# EAGLE design node (EAGLE 9.6.2)

## Sheet 1 of 5: MCU
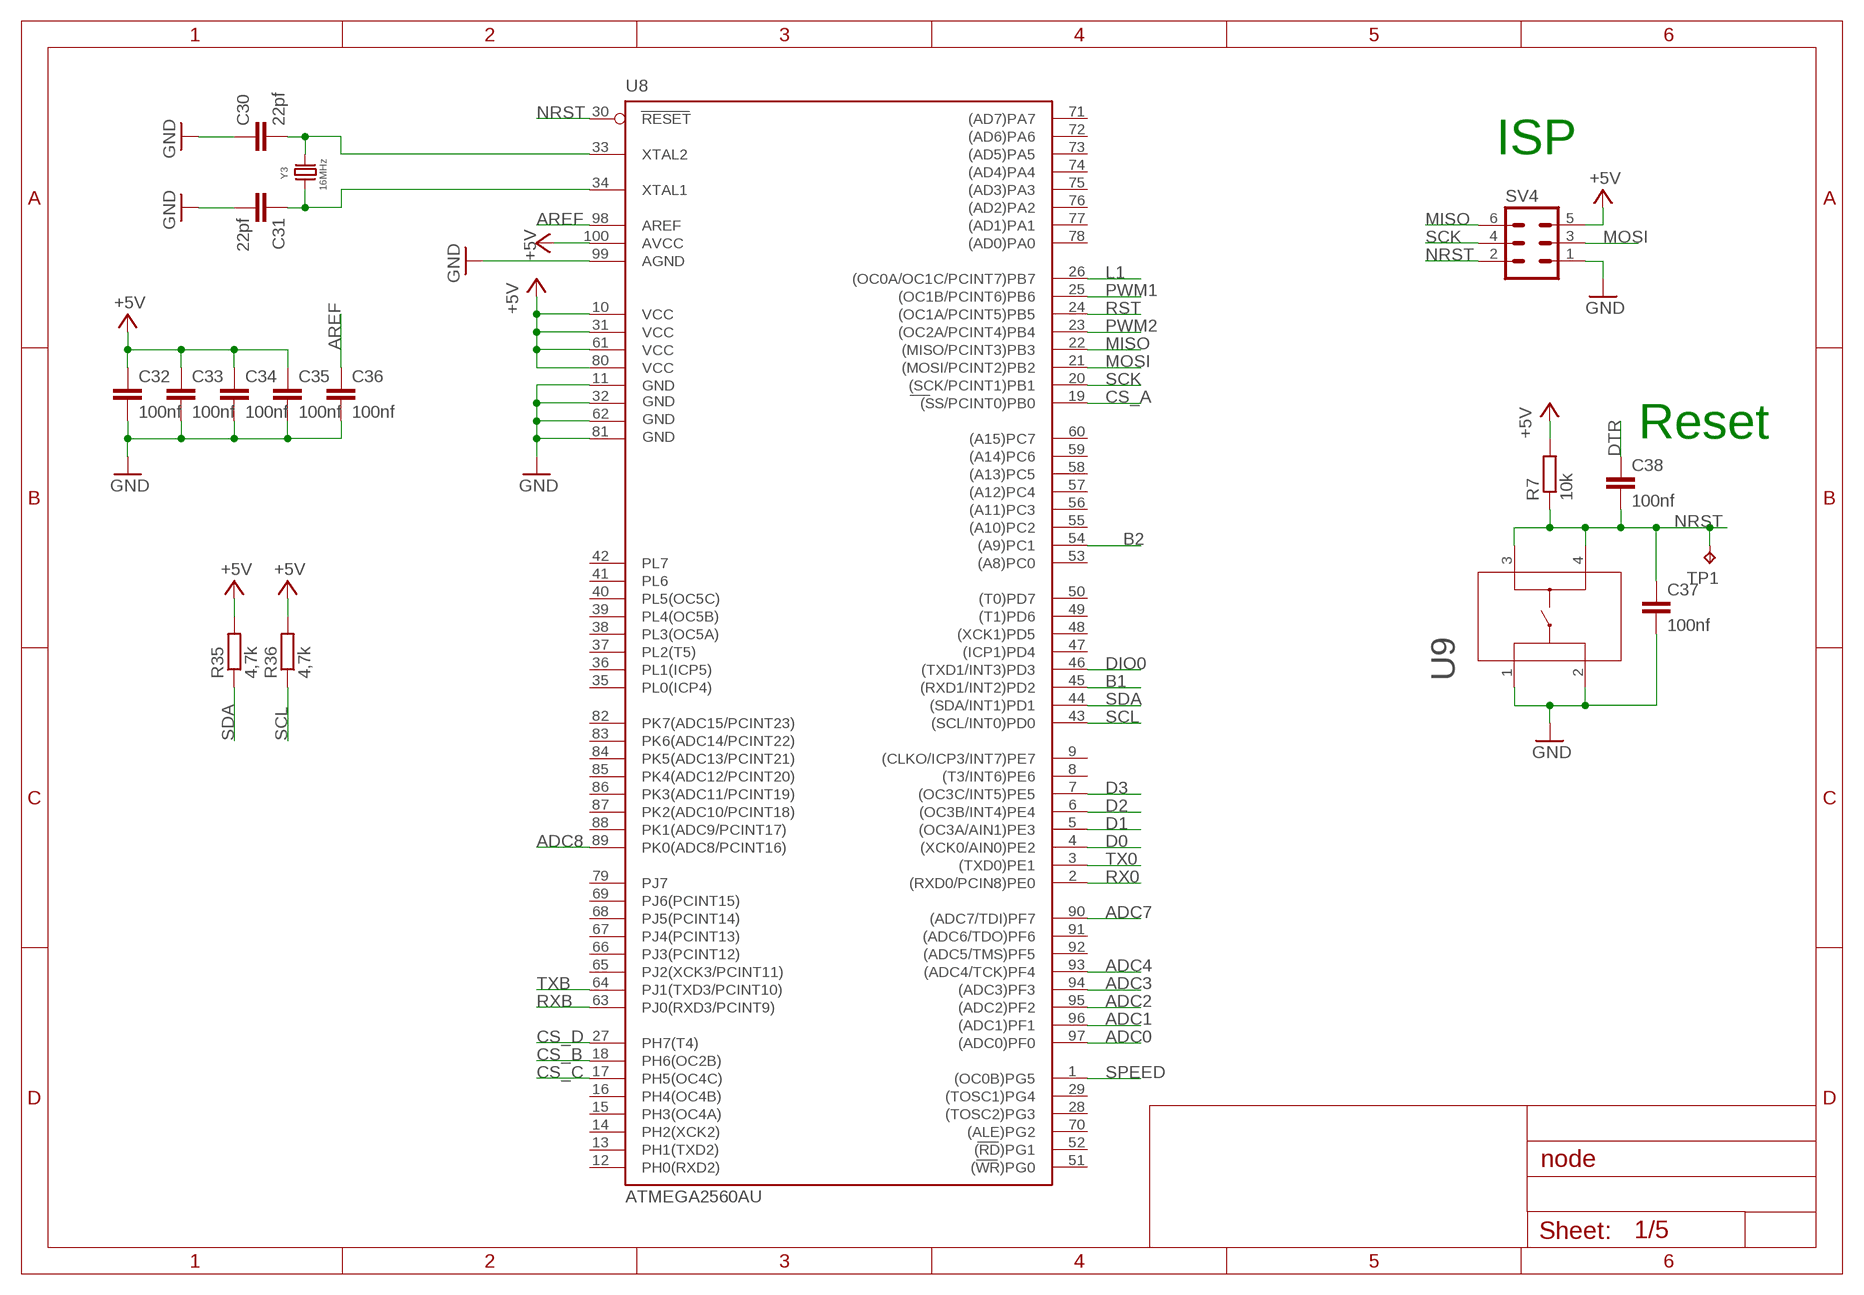
[diagram p0: schematic, sheet 1]

### Parts
C30  22pf  C-EUC0603  [C0603]
C31  22pf  C-EUC0603  [C0603]
C32  100nf  C-EUC0805  [C0805]
C33  100nf  C-EUC0805  [C0805]
C34  100nf  C-EUC0805  [C0805]
C35  100nf  C-EUC0805  [C0805]
C36  100nf  C-EUC0805  [C0805]
C37  100nf  C-EUC0805  [C0805]
C38  100nf  C-EUC0805  [C0805]
R7  10k  R-EU_R0805  [R0805]
R35  4,7k  R-EU_R0603  [R0603]
R36  4,7k  R-EU_R0603  [R0603]
SV4  MA03-2  [MA03-2]
TP1  TPTP13R  [TP13R]
U8  ATMEGA2560AU  [TQFP100]
U9  1-1825910-0  [SWITCH_1-1825910-0]
Y3  16MHz  WE-XTAL_HC49/4H_830003240B  [WE-XTAL_HC49/4H]

### Nets
+5V: C32.1 C33.1 C34.1 C35.1 R7.2 R35.2 R36.2 SV4.5 U8.10(VCC) U8.31(VCC1) U8.61(VCC2) U8.80(VCC3) U8.100(AVCC) ; also sheet 2,3,4,5
ADC0: U8.97((ADC0)PF0)
ADC1: U8.96((ADC1)PF1) ; also sheet 5
ADC2: U8.95((ADC2)PF2) ; also sheet 5
ADC3: U8.94((ADC3)PF3) ; also sheet 5
ADC4: U8.93((ADC4/TCK)PF4) ; also sheet 5
ADC7: U8.90((ADC7/TDI)PF7) ; also sheet 3
ADC8: U8.89(PK0(ADC8/PCINT16)) ; also sheet 5
AREF: C36.1 U8.98(AREF)
B1: U8.45((RXD1/INT2)PD2) ; also sheet 5
B2: U8.54((A9)PC1) ; also sheet 5
CS_A: U8.19((SS/PCINT0)PB0) ; also sheet 2
CS_B: U8.18(PH6(OC2B)) ; also sheet 3
CS_C: U8.17(PH5(OC4C)) ; also sheet 3
CS_D: U8.27(PH7(T4)) ; also sheet 3
D0: U8.4((XCK0/AIN0)PE2) ; also sheet 5
D1: U8.5((OC3A/AIN1)PE3) ; also sheet 5
D2: U8.6((OC3B/INT4)PE4) ; also sheet 5
D3: U8.7((OC3C/INT5)PE5) ; also sheet 5
DIO0: U8.46((TXD1/INT3)PD3) ; also sheet 2
DTR: C38.1 ; also sheet 2
GND: C30.1 C31.2 C32.2 C33.2 C34.2 C35.2 C36.2 C37.2 SV4.1 U8.11(GND) U8.32(GND1) U8.62(GND2) U8.81(GND3) U8.99(AGND) U9.1 U9.2 ; also sheet 2,3,4,5
L1: U8.26((OC0A/OC1C/PCINT7)PB7) ; also sheet 2
MISO: SV4.6 U8.22((MISO/PCINT3)PB3) ; also sheet 2,3
MOSI: SV4.3 U8.21((MOSI/PCINT2)PB2) ; also sheet 2,3
N$23: C30.2 U8.33(XTAL2) Y3.2
N$27: C31.1 U8.34(XTAL1) Y3.1
NRST: C37.1 C38.2 R7.1 SV4.2 TP1.TP U8.30(RESET) U9.3 U9.4
PWM1: U8.25((OC1B/PCINT6)PB6) ; also sheet 2
PWM2: U8.23((OC2A/PCINT4)PB4) ; also sheet 2
RST: U8.24((OC1A/PCINT5)PB5) ; also sheet 2
RX0: U8.2((RXD0/PCIN8)PE0) ; also sheet 2
RXB: U8.63(PJ0(RXD3/PCINT9)) ; also sheet 2
SCK: SV4.4 U8.20((SCK/PCINT1)PB1) ; also sheet 2,3
SCL: R36.1 U8.43((SCL/INT0)PD0) ; also sheet 2,3,4,5
SDA: R35.1 U8.44((SDA/INT1)PD1) ; also sheet 2,3,4,5
SPEED: U8.1((OC0B)PG5) ; also sheet 3
TX0: U8.3((TXD0)PE1) ; also sheet 2
TXB: U8.64(PJ1(TXD3/PCINT10)) ; also sheet 2
Unconnected: U8.8((T3/INT6)PE6) U8.9((CLKO/ICP3/INT7)PE7) U8.12(PH0(RXD2)) U8.13(PH1(TXD2)) U8.14(PH2(XCK2)) U8.15(PH3(OC4A)) U8.16(PH4(OC4B)) U8.28((TOSC2)PG3) U8.29((TOSC1)PG4) U8.35(PL0(ICP4)) U8.36(PL1(ICP5)) U8.37(PL2(T5)) U8.38(PL3(OC5A)) U8.39(PL4(OC5B)) U8.40(PL5(OC5C)) U8.41(PL6) U8.42(PL7) U8.47((ICP1)PD4) U8.48((XCK1)PD5) U8.49((T1)PD6) U8.50((T0)PD7) U8.51((WR)PG0) U8.52((RD)PG1) U8.53((A8)PC0) U8.55((A10)PC2) U8.56((A11)PC3) U8.57((A12)PC4) U8.58((A13)PC5) U8.59((A14)PC6) U8.60((A15)PC7) U8.65(PJ2(XCK3/PCINT11)) U8.66(PJ3(PCINT12)) U8.67(PJ4(PCINT13)) U8.68(PJ5(PCINT14)) U8.69(PJ6(PCINT15)) U8.70((ALE)PG2) U8.71((AD7)PA7) U8.72((AD6)PA6) U8.73((AD5)PA5) U8.74((AD4)PA4) U8.75((AD3)PA3) U8.76((AD2)PA2) U8.77((AD1)PA1) U8.78((AD0)PA0) U8.79(PJ7) U8.82(PK7(ADC15/PCINT23)) U8.83(PK6(ADC14/PCINT22)) U8.84(PK5(ADC13/PCINT21)) U8.85(PK4(ADC12/PCINT20)) U8.86(PK3(ADC11/PCINT19)) U8.87(PK2(ADC10/PCINT18)) U8.88(PK1(ADC9/PCINT17)) U8.91((ADC6/TDO)PF6) U8.92((ADC5/TMS)PF5)

### Notes on the sheet
- ISP
- Reset

## Sheet 2 of 5
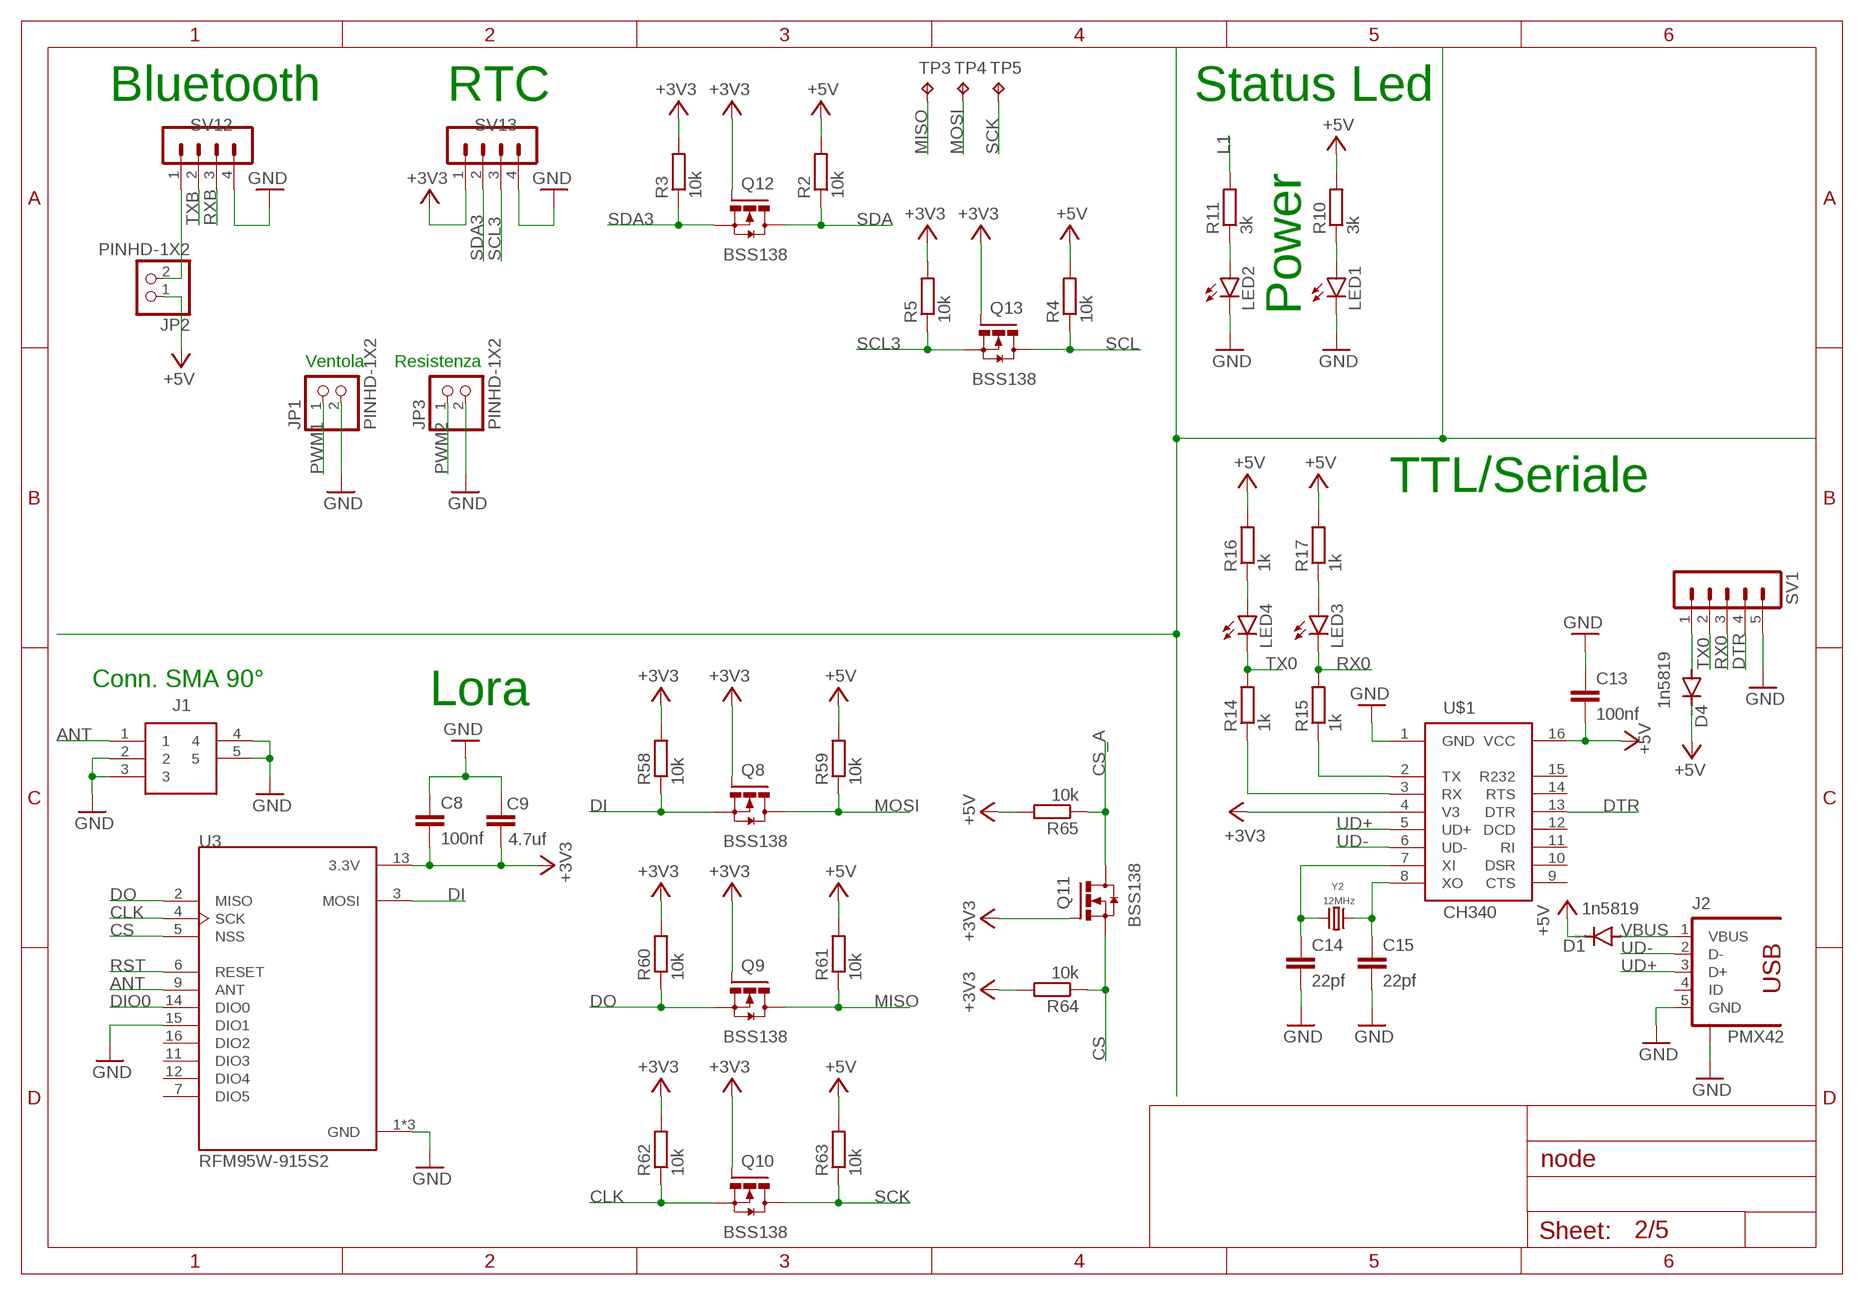
[diagram p1: schematic, sheet 2]

### Parts
C8  100nf  C-EUC0805  [C0805]
C9  4.7uf  C-EUC1206K  [C1206K]
C13  100nf  C-EUC0805  [C0805]
C14  22pf  C-EUC0603  [C0603]
C15  22pf  C-EUC0603  [C0603]
D1  1n5819  DIODE-SOD123  [SOD123]
D4  1n5819  DIODE-SOD123  [SOD123]
J1  5-1814400-1  [518144001]
J2  PMX42  PMX42_56579-0576  [PMX42_56579-0576]
JP1  PINHD-1X2  [1X02]
JP2  PINHD-1X2  [1X02]
JP3  PINHD-1X2  [1X02]
LED1  LEDSML0805  [SML0805]
LED2  LEDSML0805  [SML0805]
LED3  LEDSML0805  [SML0805]
LED4  LEDSML0805  [SML0805]
Q8  BSS138  [SOT23-3]
Q9  BSS138  [SOT23-3]
Q10  BSS138  [SOT23-3]
Q11  BSS138  [SOT23-3]
Q12  BSS138  [SOT23-3]
Q13  BSS138  [SOT23-3]
R2  10k  R-EU_R0805  [R0805]
R3  10k  R-EU_R0805  [R0805]
R4  10k  R-EU_R0805  [R0805]
R5  10k  R-EU_R0805  [R0805]
R10  3k  R-EU_R0805  [R0805]
R11  3k  R-EU_R0805  [R0805]
R14  1k  R-EU_R0805  [R0805]
R15  1k  R-EU_R0805  [R0805]
R16  1k  R-EU_R0805  [R0805]
R17  1k  R-EU_R0805  [R0805]
R58  10k  R-EU_R0805  [R0805]
R59  10k  R-EU_R0805  [R0805]
R60  10k  R-EU_R0805  [R0805]
R61  10k  R-EU_R0805  [R0805]
R62  10k  R-EU_R0805  [R0805]
R63  10k  R-EU_R0805  [R0805]
R64  10k  R-EU_R0805  [R0805]
R65  10k  R-EU_R0805  [R0805]
SV1  MA05-1  [MA05-1]
SV12  MA04-1  [MA04-1]
SV13  MA04-1  [MA04-1]
TP3  TPTP13R  [TP13R]
TP4  TPTP13R  [TP13R]
TP5  TPTP13R  [TP13R]
U3  RFM95W-915S2  [XCVR_RFM95W-915S2]
U$1  CH340  [SOIC16]
Y2  12MHz  WE-XTAL_HC49/4H_830003063B  [WE-XTAL_HC49/4H]

### Nets
+3V3: C8.2 C9.1 Q8.1(G) Q9.1(G) Q10.1(G) Q11.1(G) Q12.1(G) Q13.1(G) R3.2 R5.2 R58.2 R60.2 R62.2 R64.2 SV13.1 U3.13(3.3V) U$1.4(V3) ; also sheet 4
+5V: C13.2 D1.C D4.C JP2.1 R2.2 R4.2 R10.2 R16.2 R17.2 R59.2 R61.2 R63.2 R65.2 U$1.16(VCC) ; also sheet 1,3,4,5
ANT: J1.1 U3.9(ANT)
CLK: Q10.2(S) R62.1 U3.4(SCK)
CS: Q11.2(S) R64.1 U3.5(NSS)
CS_A: Q11.3(D) R65.1 ; also sheet 1
DI: Q8.2(S) R58.1 U3.3(MOSI)
DIO0: U3.14(DIO0) ; also sheet 1
DO: Q9.2(S) R60.1 U3.2(MISO)
DTR: SV1.4 U$1.13(DTR) ; also sheet 1
GND: C8.1 C9.2 C13.1 C14.2 C15.2 J1.2 J1.3 J1.4 J1.5 J2.5(GND) J2.S1(S) J2.S2(S) J2.S3(S) J2.S4(S) JP1.2 JP3.2 LED1.C LED2.C SV1.5 SV12.4 SV13.4 U3.1(GND) U3.8(GND) U3.10(GND) U3.15(DIO1) U$1.1(GND) ; also sheet 1,3,4,5
L1: R11.2 ; also sheet 1
MISO: Q9.3(D) R61.1 TP3.TP ; also sheet 1,3
MOSI: Q8.3(D) R59.1 TP4.TP ; also sheet 1,3
N$1: JP2.2 SV12.1
N$10: LED1.A R10.1
N$11: LED2.A R11.1
N$13: R15.1 U$1.2(TX)
N$14: R14.1 U$1.3(RX)
N$15: C15.1 U$1.8(XO) Y2.1
N$16: C14.1 U$1.7(XI) Y2.2
N$17: LED3.A R17.1
N$18: LED4.A R16.1
N$24: D4.A SV1.1
PWM1: JP1.1 ; also sheet 1
PWM2: JP3.1 ; also sheet 1
RST: U3.6(RESET) ; also sheet 1
RX0: LED3.C R15.2 SV1.3 ; also sheet 1
RXB: SV12.3 ; also sheet 1
SCK: Q10.3(D) R63.1 TP5.TP ; also sheet 1,3
SCL: Q13.3(D) R4.1 ; also sheet 1,3,4,5
SCL3: Q13.2(S) R5.1 SV13.3
SDA: Q12.3(D) R2.1 ; also sheet 1,3,4,5
SDA3: Q12.2(S) R3.1 SV13.2
TX0: LED4.C R14.2 SV1.2 ; also sheet 1
TXB: SV12.2 ; also sheet 1
UD+: J2.3(D+) U$1.5(UD+)
UD-: J2.2(D-) U$1.6(UD-)
VBUS: D1.A J2.1(VBUS)
Unconnected: J2.4(ID) U3.7(DIO5) U3.11(DIO3) U3.12(DIO4) U3.16(DIO2) U$1.9(CTS) U$1.10(DSR) U$1.11(RI) U$1.12(DCD) U$1.14(RTS) U$1.15(R232)

### Notes on the sheet
- Bluetooth | RTC | Status Led
- Power
- Ventola | Resistenza
- TTL/Seriale
- Conn. SMA 90°
- Lora

## Sheet 3 of 5
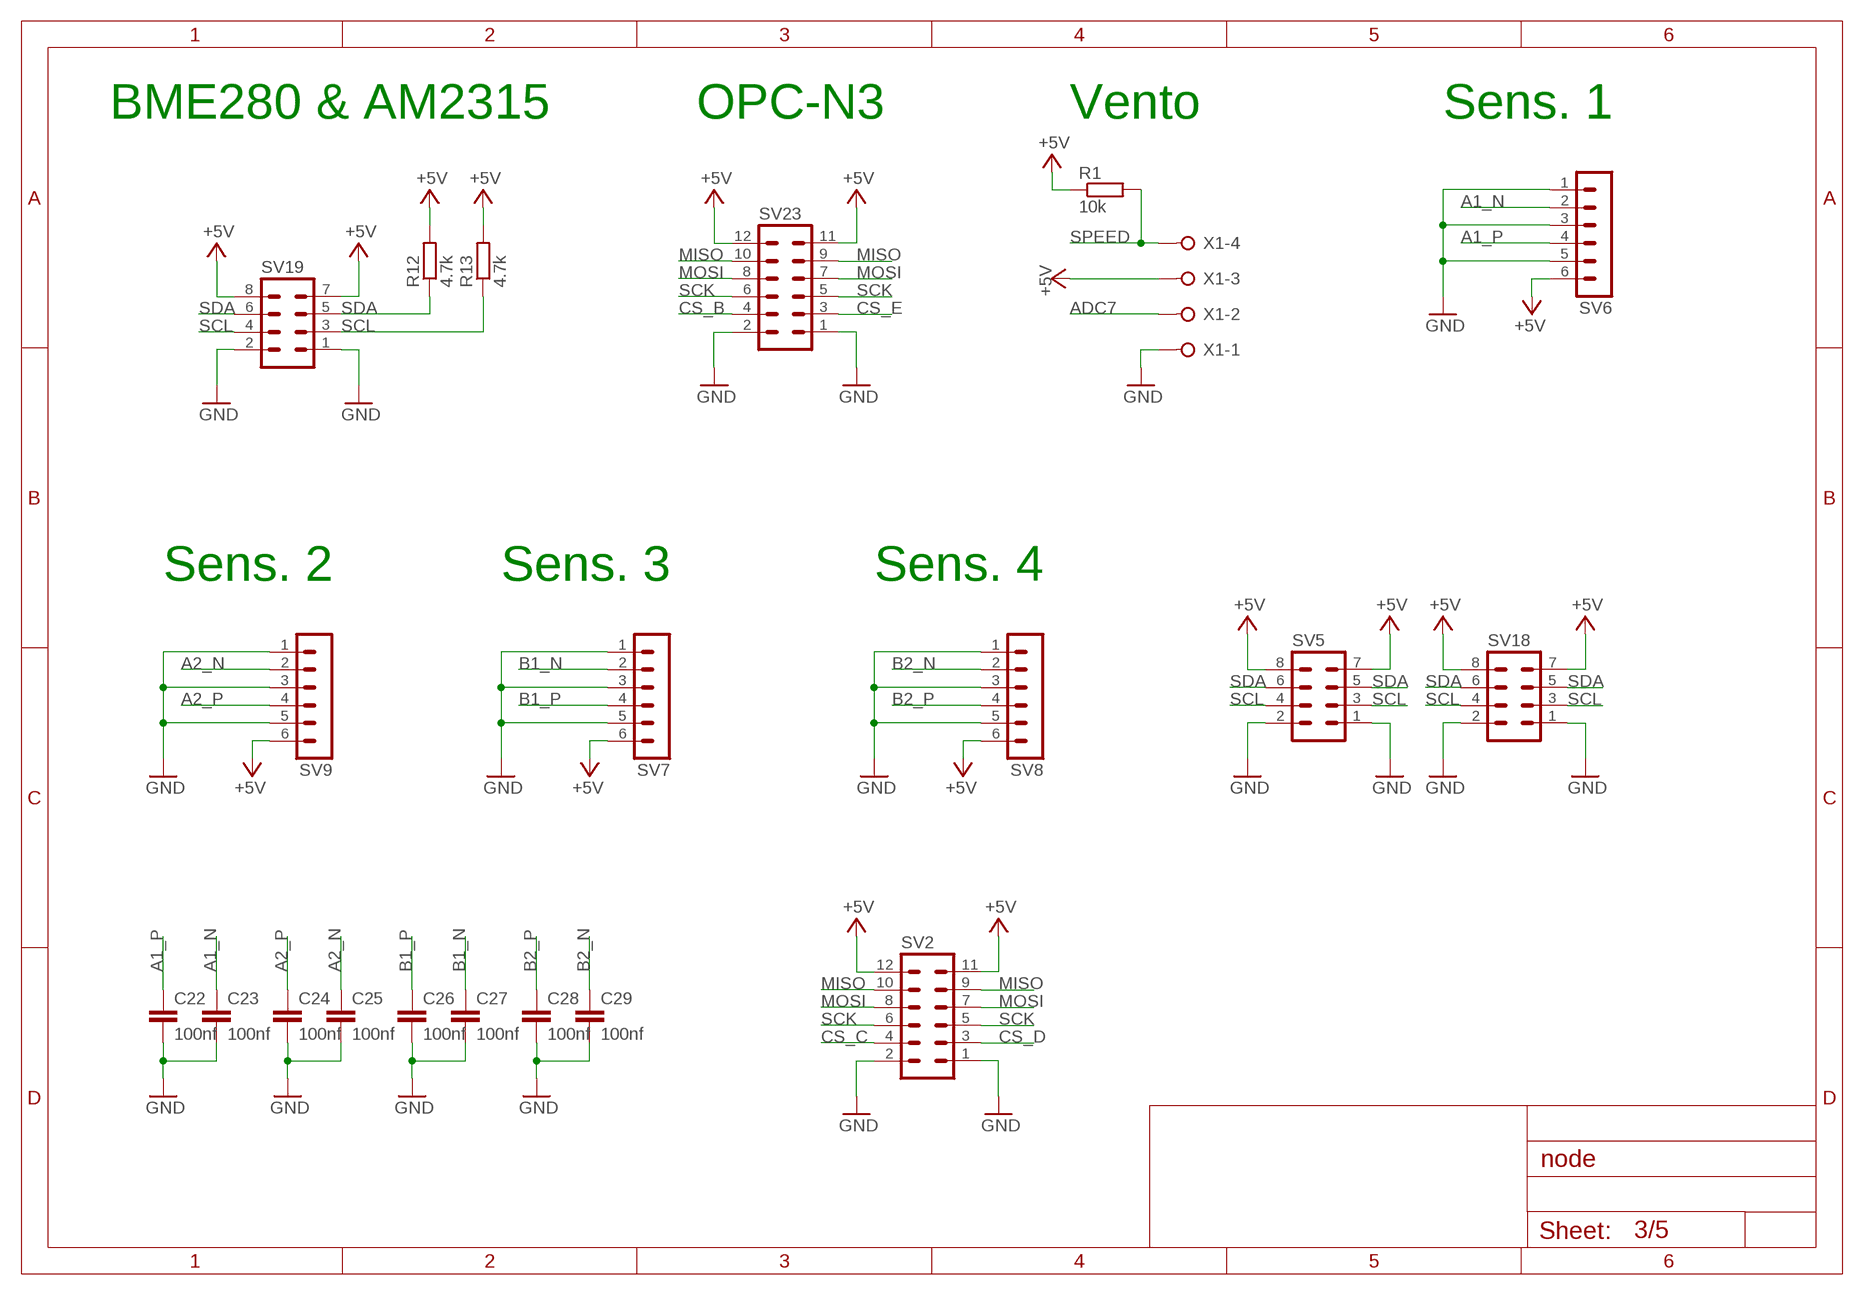
[diagram p2: schematic, sheet 3]

### Parts
C22  100nf  C-EUC0805  [C0805]
C23  100nf  C-EUC0805  [C0805]
C24  100nf  C-EUC0805  [C0805]
C25  100nf  C-EUC0805  [C0805]
C26  100nf  C-EUC0805  [C0805]
C27  100nf  C-EUC0805  [C0805]
C28  100nf  C-EUC0805  [C0805]
C29  100nf  C-EUC0805  [C0805]
R1  10k  R-EU_R0805  [R0805]
R12  4.7k  R-EU_R0603  [R0603]
R13  4.7k  R-EU_R0603  [R0603]
SV2  MA06-2  [MA06-2]
SV5  MA04-2  [MA04-2]
SV6  MA06-1  [MA06-1]
SV7  MA06-1  [MA06-1]
SV8  MA06-1  [MA06-1]
SV9  MA06-1  [MA06-1]
SV18  MA04-2  [MA04-2]
SV19  MA04-2  [MA04-2]
SV23  MA06-2  [MA06-2]
X1  W237-04P  [W237-4P]

### Nets
+5V: R1.1 R12.2 R13.2 SV2.11 SV2.12 SV5.7 SV5.8 SV6.6 SV7.6 SV8.6 SV9.6 SV18.7 SV18.8 SV19.7 SV19.8 SV23.11 SV23.12 X1.3 ; also sheet 1,2,4,5
A1_N [diff pair]: C23.1 SV6.2 ; also sheet 4
A1_P [diff pair]: C22.1 SV6.4 ; also sheet 4
A2_N [diff pair]: C25.1 SV9.2 ; also sheet 4
A2_P [diff pair]: C24.1 SV9.4 ; also sheet 4
ADC7: X1.2 ; also sheet 1
B1_N [diff pair]: C27.1 SV7.2 ; also sheet 4
B1_P [diff pair]: C26.1 SV7.4 ; also sheet 4
B2_N [diff pair]: C29.1 SV8.2 ; also sheet 4
B2_P [diff pair]: C28.1 SV8.4 ; also sheet 4
CS_B: SV23.4 ; also sheet 1
CS_C: SV2.4 ; also sheet 1
CS_D: SV2.3 ; also sheet 1
CS_E: SV23.3
GND: C22.2 C23.2 C24.2 C25.2 C26.2 C27.2 C28.2 C29.2 SV2.1 SV2.2 SV5.1 SV5.2 SV6.1 SV6.3 SV6.5 SV7.1 SV7.3 SV7.5 SV8.1 SV8.3 SV8.5 SV9.1 SV9.3 SV9.5 SV18.1 SV18.2 SV19.1 SV19.2 SV23.1 SV23.2 X1.1 ; also sheet 1,2,4,5
MISO: SV2.9 SV2.10 SV23.9 SV23.10 ; also sheet 1,2
MOSI: SV2.7 SV2.8 SV23.7 SV23.8 ; also sheet 1,2
SCK: SV2.5 SV2.6 SV23.5 SV23.6 ; also sheet 1,2
SCL: R13.1 SV5.3 SV5.4 SV18.3 SV18.4 SV19.3 SV19.4 ; also sheet 1,2,4,5
SDA: R12.1 SV5.5 SV5.6 SV18.5 SV18.6 SV19.5 SV19.6 ; also sheet 1,2,4,5
SPEED: R1.2 X1.4 ; also sheet 1

### Notes on the sheet
- BME280 & AM2315 | OPC-N3 | Vento | Sens. 1
- Sens. 2 | Sens. 3 | Sens. 4

## Sheet 4 of 5
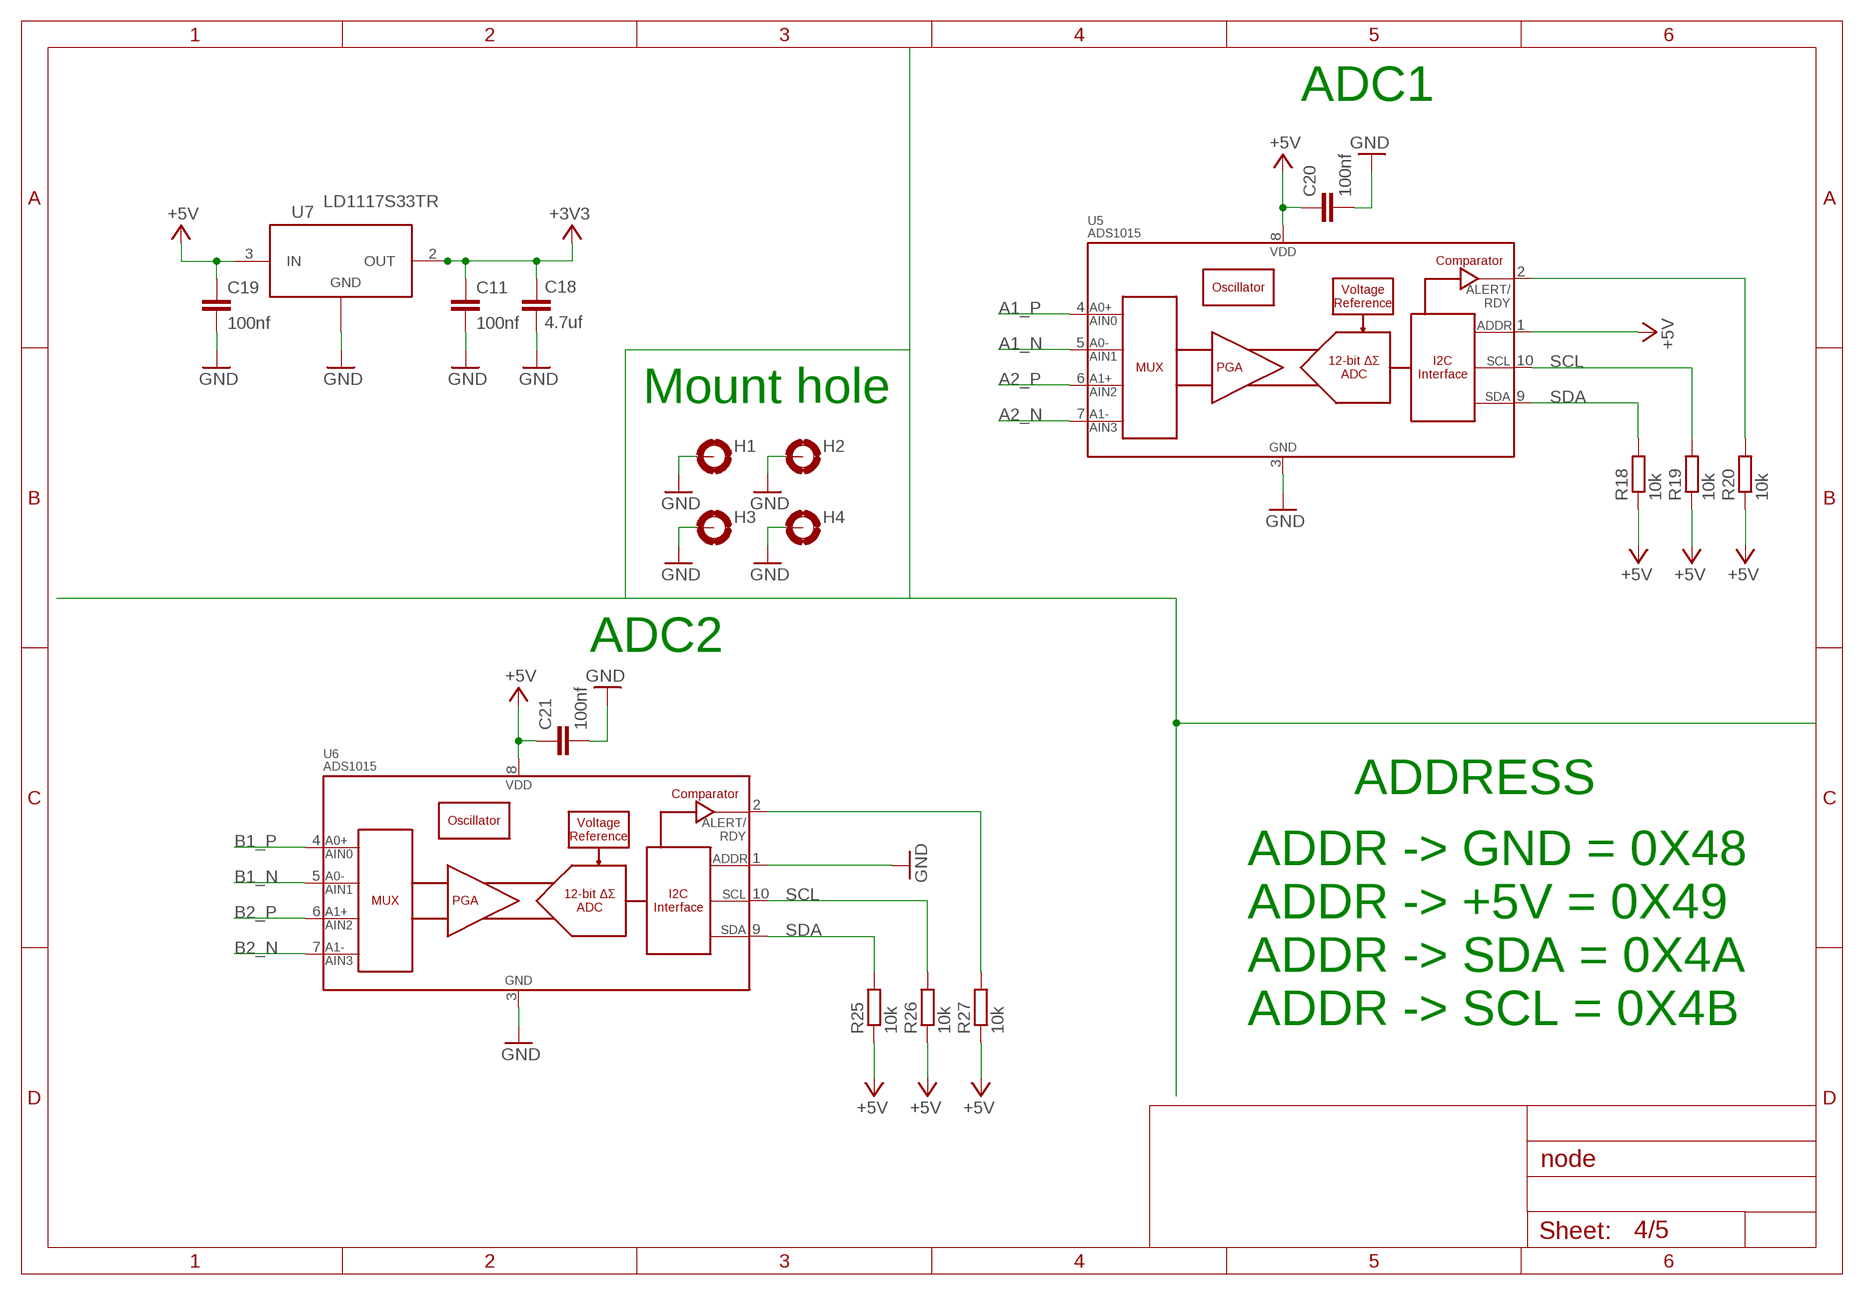
[diagram p3: schematic, sheet 4]

### Parts
C11  100nf  C-EUC0805  [C0805]
C18  4.7uf  C-EUC1206K  [C1206K]
C19  100nf  C-EUC0805  [C0805]
C20  100nf  C-EUC0805  [C0805]
C21  100nf  C-EUC0805  [C0805]
H1  MOUNT-PAD-ROUND3.2  [3,2-PAD]
H2  MOUNT-PAD-ROUND3.2  [3,2-PAD]
H3  MOUNT-PAD-ROUND3.2  [3,2-PAD]
H4  MOUNT-PAD-ROUND3.2  [3,2-PAD]
R18  10k  R-EU_R0805  [R0805]
R19  10k  R-EU_R0805  [R0805]
R20  10k  R-EU_R0805  [R0805]
R25  10k  R-EU_R0805  [R0805]
R26  10k  R-EU_R0805  [R0805]
R27  10k  R-EU_R0805  [R0805]
U5  ADS1015  [MSOP10]
U6  ADS1015  [MSOP10]
U7  LD1117S33TR  [SOT-223]

### Nets
+3V3: C11.1 C18.1 U7.2(OUT) U7.4 ; also sheet 2
+5V: C19.1 C20.1 C21.1 R18.1 R19.1 R20.1 R25.1 R26.1 R27.1 U5.1(ADDR) U5.8(VDD) U6.8(VDD) U7.3(IN) ; also sheet 1,2,3,5
A1_N [diff pair]: U5.5(AIN1) ; also sheet 3
A1_P [diff pair]: U5.4(AIN0) ; also sheet 3
A2_N [diff pair]: U5.7(AIN3) ; also sheet 3
A2_P [diff pair]: U5.6(AIN2) ; also sheet 3
B1_N [diff pair]: U6.5(AIN1) ; also sheet 3
B1_P [diff pair]: U6.4(AIN0) ; also sheet 3
B2_N [diff pair]: U6.7(AIN3) ; also sheet 3
B2_P [diff pair]: U6.6(AIN2) ; also sheet 3
GND: C11.2 C18.2 C19.2 C20.2 C21.2 H1.B3,2(MOUNT) H2.B3,2(MOUNT) H3.B3,2(MOUNT) H4.B3,2(MOUNT) U5.3(VSS) U6.1(ADDR) U6.3(VSS) U7.1(ADJ/GND) ; also sheet 1,2,3,5
N$22: R20.2 U5.2(ALERT/RDY)
N$25: R27.2 U6.2(ALERT/RDY)
SCL: R19.2 R26.2 U5.10(SCL) U6.10(SCL) ; also sheet 1,2,3,5
SDA: R18.2 R25.2 U5.9(SDA) U6.9(SDA) ; also sheet 1,2,3,5

### Notes on the sheet
- ADC1
- Mount hole
- ADC2
- ADDRESS
- ADDR -> GND = 0X48
- ADDR -> +5V = 0X49
- ADDR -> SDA = 0X4A
- ADDR -> SCL = 0X4B

## Sheet 5 of 5
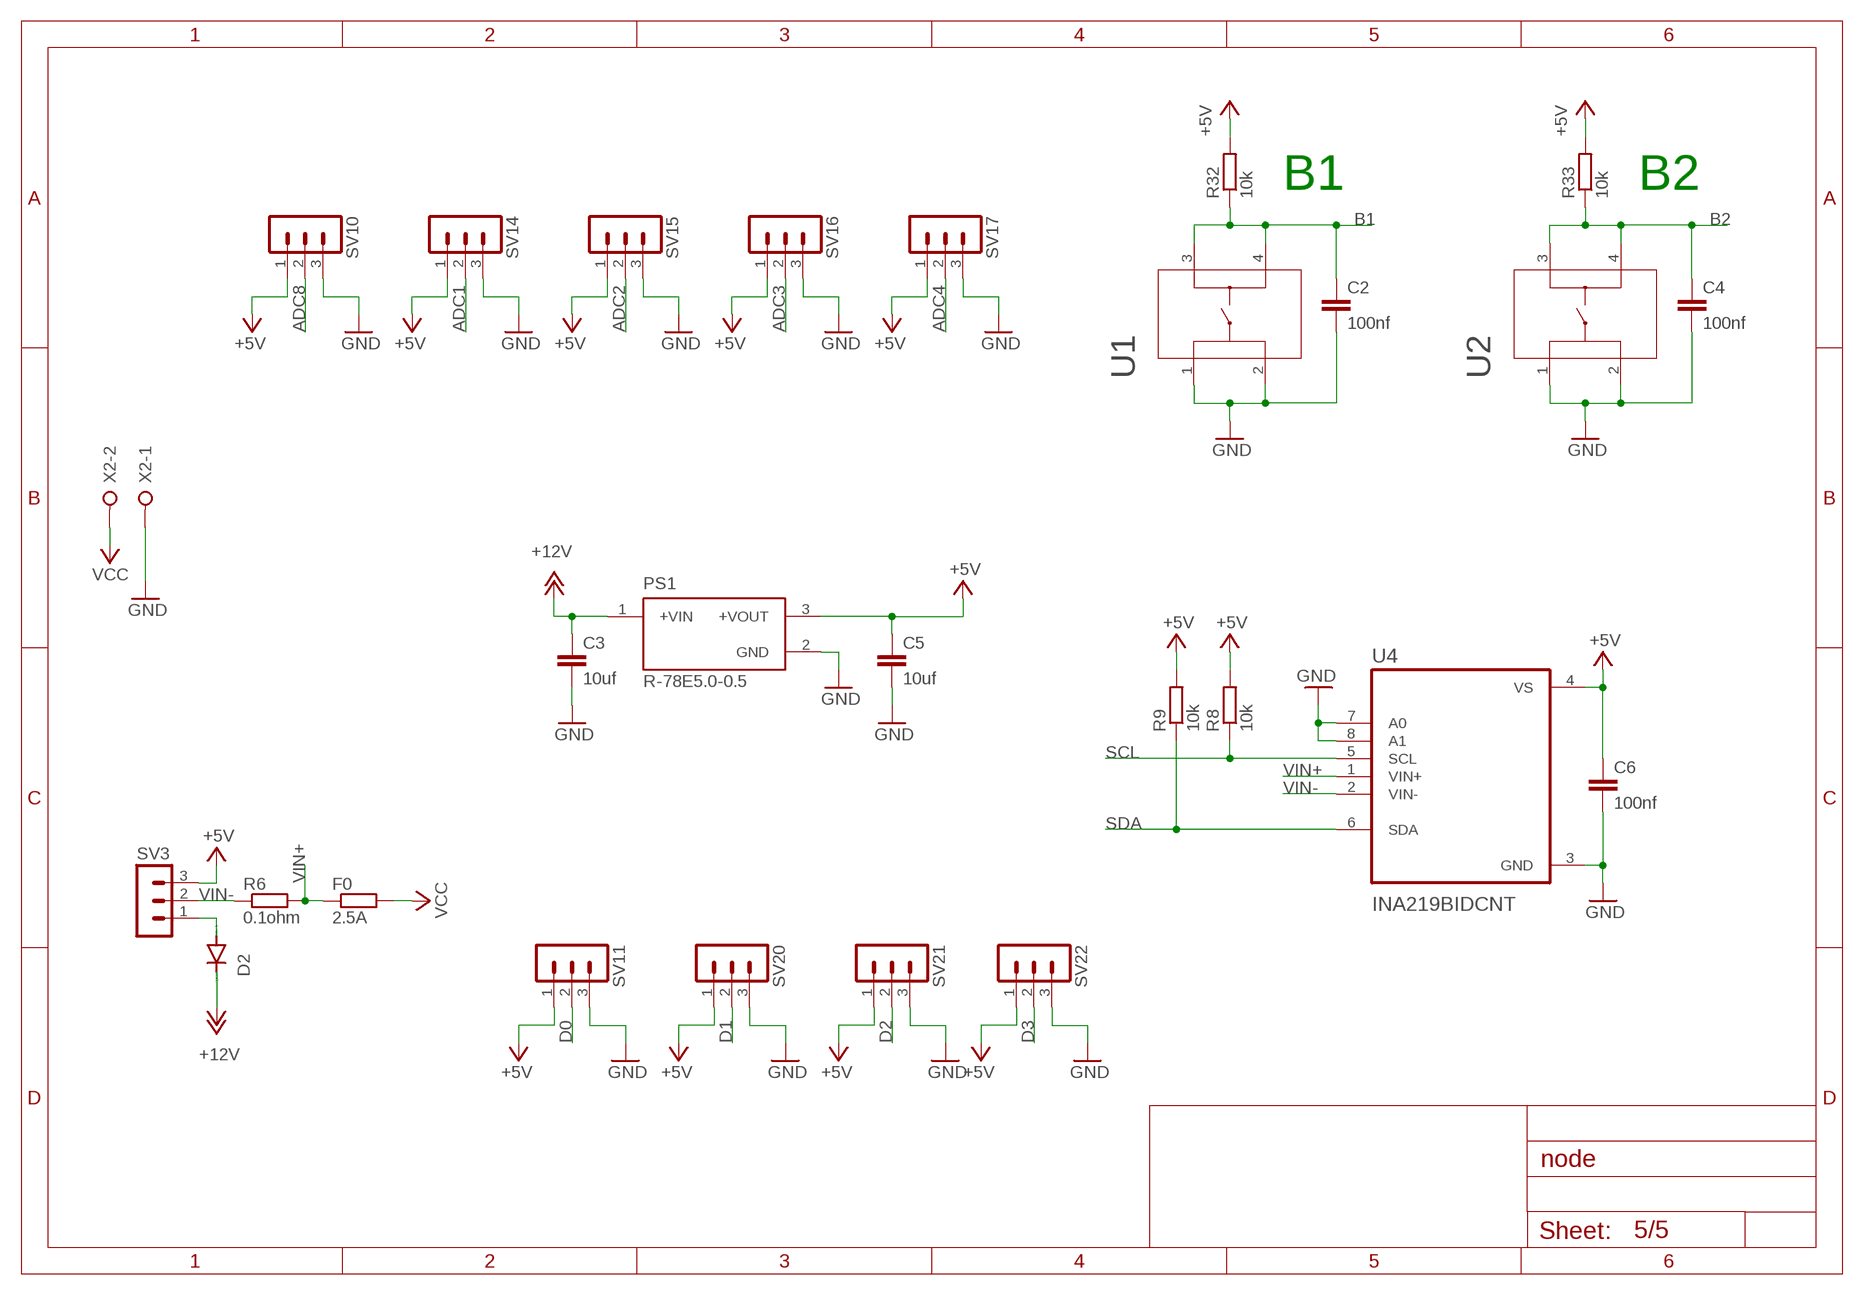
[diagram p4: schematic, sheet 5]

### Parts
C2  100nf  C-EUC0805  [C0805]
C3  10uf  C-EUC1206  [C1206]
C4  100nf  C-EUC0805  [C0805]
C5  10uf  C-EUC1206  [C1206]
C6  100nf  C-EUC0805  [C0805]
D2  DIODE-SOD123  [SOD123]
F0  2.5A  R-EU_R0805  [R0805]
PS1  R-78E5.0-0.5  [CONV_R-78E5.0-0.5]
R6  0.1ohm  R-EU_R2512  [R2512]
R8  10k  R-EU_R0805  [R0805]
R9  10k  R-EU_R0805  [R0805]
R32  10k  R-EU_R0805  [R0805]
R33  10k  R-EU_R0805  [R0805]
SV3  MA03-1  [MA03-1]
SV10  MA03-1  [MA03-1]
SV11  MA03-1  [MA03-1]
SV14  MA03-1  [MA03-1]
SV15  MA03-1  [MA03-1]
SV16  MA03-1  [MA03-1]
SV17  MA03-1  [MA03-1]
SV20  MA03-1  [MA03-1]
SV21  MA03-1  [MA03-1]
SV22  MA03-1  [MA03-1]
U1  1-1825910-0  [SWITCH_1-1825910-0]
U2  1-1825910-0  [SWITCH_1-1825910-0]
U4  INA219BIDCNT  [SOT65P280X145-8N]
X2  W237-02P  [W237-132]

### Nets
+5V: C5.1 C6.1 PS1.3(+VOUT) R8.2 R9.2 R32.2 R33.2 SV3.3 SV10.1 SV11.1 SV14.1 SV15.1 SV16.1 SV17.1 SV20.1 SV21.1 SV22.1 U4.4(VS) ; also sheet 1,2,3,4
+12V: C3.1 D2.C PS1.1(+VIN)
ADC1: SV14.2 ; also sheet 1
ADC2: SV15.2 ; also sheet 1
ADC3: SV16.2 ; also sheet 1
ADC4: SV17.2 ; also sheet 1
ADC8: SV10.2 ; also sheet 1
B1: C2.1 R32.1 U1.3 U1.4 ; also sheet 1
B2: C4.1 R33.1 U2.3 U2.4 ; also sheet 1
D0: SV11.2 ; also sheet 1
D1: SV20.2 ; also sheet 1
D2: SV21.2 ; also sheet 1
D3: SV22.2 ; also sheet 1
GND: C2.2 C3.2 C4.2 C5.2 C6.2 PS1.2(GND) SV10.3 SV11.3 SV14.3 SV15.3 SV16.3 SV17.3 SV20.3 SV21.3 SV22.3 U1.1 U1.2 U2.1 U2.2 U4.3(GND) U4.7(A0) U4.8(A1) X2.1 ; also sheet 1,2,3,4
N$3: D2.A SV3.1
SCL: R8.1 U4.5(SCL) ; also sheet 1,2,3,4
SDA: R9.1 U4.6(SDA) ; also sheet 1,2,3,4
VCC: F0.2 X2.2
VIN+: F0.1 R6.2 U4.1(VIN+)
VIN-: R6.1 SV3.2 U4.2(VIN-)

### Notes on the sheet
- B1 | B2

## Library data of the parts
C2-C6 C8 C9 C11 C13-C15 C18-C38 = resistor:C-EU: CAPACITOR, European symbol
D1 D2 D4 = diode:DIODE-: DIODE
F0 R1-R20 R25-R27 R32 R33 R35 R36 R58-R65 = resistor:R-EU_: RESISTOR, European symbol
H1-H4 = holes:MOUNT-PAD-ROUND: MOUNTING PAD, round
J1 = 5-1814400-1:5-1814400-1: SMA Connector Jack, Female Socket 50 Ohm Through Hole, Right Angle Solder Source: Datasheet <https://www.te.com/commerce/DocumentDelivery/DDEController?Action=showdoc&DocId=Customer Drawing1814400DpdfEnglishENG_CD_1814400_D_baseFilename.pdf5-1814400-1>; ALLIED_NUMBER: 70084631; ALLIED_PRICE-STOCK: https://www.alliedelec.com/te-connectivity-5-1814400-1/70084631/; DESCRIPTION: SMA Connector Jack, Female Socket 50 Ohm Through Hole, Right Angle Solder; HEIGHT: 10.43mm; MANUFACTURER_NAME: TE Connectivity; MANUFACTURER_PART_NUMBER: 5-1814400-1; MOUSER_PART_NUMBER: 571-5-1814400-1; MOUSER_PRICE-STOCK: https://www.mouser.co.uk/ProductDetail/TE-Connectivity/5-1814400-1?qs=ZMVvPt2N%252B83mDSbcJPKgOA%3D%3D; RS_PART_NUMBER: 6163400; RS_PRICE-STOCK: http://uk.rs-online.com/web/p/products/6163400
J2 = 52101-101-REV-A:PMX42_56579-0576: USB - OTG, miniUSB Type AB, Molex
JP1-JP3 = Connector:PINHD-1X2: PIN HEADER; CATEGORY: CONNECTOR; SUB-CATEGORY: PIN-HEADER
LED1-LED4 = led:LED: LED OSRAM: - CHIPLED LG R971, LG N971, LY N971, LG Q971, LY Q971, LO R971, LY R971 LH N974, LH R974 LS Q976, LO Q976, LY Q976 LO Q996 - Hyper CHIPLED LW Q18S LB Q993, LB Q99A, LB R99A - SideLED LS A670, LO A670, LY A670, LG A670, LP A670 LB A673, LV A673, LT A673, LW A673 LH A674 LY A675 LS A676, LA A676, LO A676, LY A676, LW A676 LS A679, LY A679, LG A679 - Hyper Micro SIDELED® LS Y876, LA Y876, LO Y876, LY Y876 LT Y87S - SmartLED LW L88C, LW L88S LB L89C, LB L89S, LG L890 LS L89K, LO L89K, LY L89K LS L896, LA L896, LO L896, LY L896 - TOPLED LS T670, LO T670, LY T670, LG T670, LP T670 LSG T670, LSP T670, LSY T670, LOP T670, LYG T670 LG T671, LOG T671, LSG T671 LB T673, LV T673, LT T673, LW T673 LH T674 LS T676, LA T676, LO T676, LY T676, LB T676, LH T676, LSB T676, LW T676 LB T67C, LV T67C, LT T67C, LS T67K, LO T67K, LY T67K, LW E67C LS E67B, LA E67B, LO E67B, LY E67B, LB E67C, LV E67C, LT E67C LW T67C LS T679, LY T679, LG T679 LS T770, LO T770, LY T770, LG T770, LP T770 LB T773, LV T773, LT T773, LW T773 LH T774 LS E675, LA E675, LY E675, LS T675 LS T776, LA T776, LO T776, LY T776, LB T776 LHGB T686 LT T68C, LB T68C - Hyper Mini TOPLED® LB M676 - Mini TOPLED Santana® LG M470 LS M47K, LO M47K, LY M47K Source: http://www.osram.convergy.de LUXEON: - LUMILED® LXK2-PW12-R00, LXK2-PW12-S00, LXK2-PW14-U00, LXK2-PW14-V00 LXK2-PM12-R00, LXK2-PM12-S00, LXK2-PM14-U00 LXK2-PE12-Q00, LXK2-PE12-R00, LXK2-PE12-S00, LXK2-PE14-T00, LXK2-PE14-U00 LXK2-PB12-K00, LXK2-PB12-L00, LXK2-PB12-M00, LXK2-PB14-N00, LXK2-PB14-P00, LXK2-PB14-Q00 LXK2-PR12-L00, LXK2-PR12-M00, LXK2-PR14-Q00, LXK2-PR14-R00 LXK2-PD12-Q00, LXK2-PD12-R00, LXK2-PD12-S00 LXK2-PH12-R00, LXK2-PH12-S00 LXK2-PL12-P00, LXK2-PL12-Q00, LXK2-PL12-R00 Source: www.luxeon.com KINGBRIGHT: KA-3528ASYC Source: www.kingbright.com
PS1 = R-78E5.0-0.5:R-78E5.0-0.5: 0.5 Amp SIP3 Single Output; ARROW_ELECTRONICS-PURCHASE-URL: https://snapeda.com/shop?store=Arrow+Electronics&id=229067; AVAILABILITY: Unavailable; DESCRIPTION: Switching regulator module - DC/DC converter . Single Output. 7.0V to 28.0V input voltage range and 5 V output voltage range; DIGIKEY-PURCHASE-URL: https://snapeda.com/shop?store=DigiKey&id=229067; MF: Recom Power; MOUSER-PURCHASE-URL: https://snapeda.com/shop?store=Mouser&id=229067; MP: R-78E5.0-0.5; PACKAGE: SIP-3 Recom Power; PRICE: None
Q8-Q13 = Transistor:BSS138: MOSFET N-CH 50V 220MA SOT-23 Manufacturer's datasheet <https://www.onsemi.com/pub/Collateral/BSS138-D.PDF>; CREATED_BY: PCBLayout.com; DIGIKEY_PART_NUMBER: BSS138CT-ND; MANUFACTURER: ON Semiconductor; MPN: BSS138; PACKAGE: SOT-23
SV1 = con-lstb:MA05-1: PIN HEADER; OC_FARNELL: unknown; OC_NEWARK: unknown
SV2 SV23 = con-lstb:MA06-2: PIN HEADER; OC_FARNELL: unknown; OC_NEWARK: unknown
SV3 SV10 SV11 SV14-SV17 SV20-SV22 = con-lstb:MA03-1: PIN HEADER; OC_FARNELL: unknown; OC_NEWARK: unknown
SV4 = con-lstb:MA03-2: PIN HEADER; OC_FARNELL: unknown; OC_NEWARK: unknown
SV5 SV18 SV19 = con-lstb:MA04-2: PIN HEADER; OC_FARNELL: unknown; OC_NEWARK: unknown
SV6-SV9 = con-lstb:MA06-1: PIN HEADER; OC_FARNELL: unknown; OC_NEWARK: unknown
SV12 SV13 = con-lstb:MA04-1: PIN HEADER; OC_FARNELL: unknown; OC_NEWARK: unknown
TP1 TP3-TP5 = testpad:TP: Test pad
U1 U2 U9 = Switches:1-1825910-0; BUILT_BY: EMA_UL_Team; CATEGORY: Tactile Switches; COPYRIGHT: Copyright (C) 2016 Accelerated Designs. All rights reserved; DESCRIPTION: FSM6JH=6MM TACT SWITCH, HIGH TEMP; MANUFACTURER_PART_NUMBER: 1-1825910-0; PART_STATUS: active; SERIES: Unknown; VENDOR: TE Connectivity
U3 = RFM95W-915S2:RFM95W-915S2: RFM95(W) - Low Power Long Range Transceiver Module V1.0; AVAILABILITY: Unavailable; DESCRIPTION: General ISM < 1GHz LoRa™ Transceiver Module 915MHz Surface Mount; MF: RF Solutions; MP: RFM95W-915S2; PACKAGE: SMD-16 RF Solutions; PRICE: None
U4 = INA219BIDCNT:INA219BIDCNT; AVAILABILITY: Unavailable; DESCRIPTION: 26-V, Bidirectional, Zero-Drift, High-Side, I2C Out Current/Power Monitor; MF: Texas Instruments; MP: INA219BIDCNT; PACKAGE: SOT-23-8 Texas Instruments; PRICE: None; TEXAS_INSTRUMENTS-PURCHASE-URL: https://snapeda.com/shop?store=Texas+Instruments&id=420868
U5 U6 = SparkFun-IC-Conversion:ADS1015: ADS1015 12-BIT ADC 12-Bit Del-Sig ADC Four single-ended inputs or two differential inputs Internal PGA I2C interface 2.0-5.5V SparkFun Products SparkFun Block for Intel Edison - ADC <https://www.sparkfun.com/products/13770> (DEV-13770); PROD_ID: IC-12270
U7 = IC:LD1117S33TR: IC REG LINEAR 3.3V 800MA SOT223 Manufacturer's datasheet <http://www.st.com/content/ccc/resource/technical/document/datasheet/99/3b/7d/91/91/51/4b/be/CD00000544.pdf/files/CD00000544.pdf/jcr:content/translations/en.CD00000544.pdf>; CREATED_BY: PCBLayout.com; DIGIKEY_PART_NUMBER: 497-1242-2-ND; MANUFACTURER: STMicroelectronics; MPN: LD1117S33TR; PACKAGE: SOT-223
U8 = SparkFun-IC-Microcontroller:ATMEGA2560: Atmel 100-pin 8-bit uC 64/128/256 Kbytes FLASH 4 Kbytes EEPROM 8 Kbytes SRAM 86 General Purpose I/O pins 12-channels16-bit PWM 4 x Serial USARTs 16-channels 10-bit A/D SparkFun Products None.; PROD_ID: IC-10040
U$1 = CH340:CH340; AVAILABILITY: Unavailable; DESCRIPTION: Circuit Breaker Magnetic 3Pole 40A 240VAC; MF: Eaton; MP: CH340; PACKAGE: None; PRICE: None
X1 = con-wago-508:W237-04P: WAGO SREW CLAMP; OC_FARNELL: unknown; OC_NEWARK: unknown
X2 = con-wago-508:W237-02P: WAGO SREW CLAMP; OC_FARNELL: unknown; OC_NEWARK: unknown
Y2 = Wurth_Quartz Crystals & Oscillators_WE-XTAL:WE-XTAL_HC49/4H: WE-XTAL Quartz Crystal Characteristics Industry standard packages <https://katalog.we-online.com/media/images/v2/o135919v209%20Family_WE-XTAL_IQXC-42.jpg> Details see: https://katalog.we-online.com/en/pbs/WE-XTAL Updated by Ella Wu , 2019-09-03 2019 (C) Wurth Elektronik; C-LOAD: 20pF; DATASHEET-URL: https://www.we-online.com/catalog/datasheet/830003063B.pdf; MOUNT: THT; PART-NUMBER: 830003063B; STABILITY: 50ppm; TOLERANCE: ±30ppm; VALUE: 3.579545MHz
Y3 = Wurth_Quartz Crystals & Oscillators_WE-XTAL:WE-XTAL_HC49/4H: WE-XTAL Quartz Crystal Characteristics Industry standard packages <https://katalog.we-online.com/media/images/v2/o135919v209%20Family_WE-XTAL_IQXC-42.jpg> Details see: https://katalog.we-online.com/en/pbs/WE-XTAL Updated by Ella Wu , 2019-09-03 2019 (C) Wurth Elektronik; C-LOAD: 30pF; DATASHEET-URL: https://www.we-online.com/catalog/datasheet/830003240B.pdf; MOUNT: THT; PART-NUMBER: 830003240B; STABILITY: 50ppm; TOLERANCE: ±30ppm

## Net classes
1 diff pair: width 0.305 mm, clearance 0.127 mm

## Board
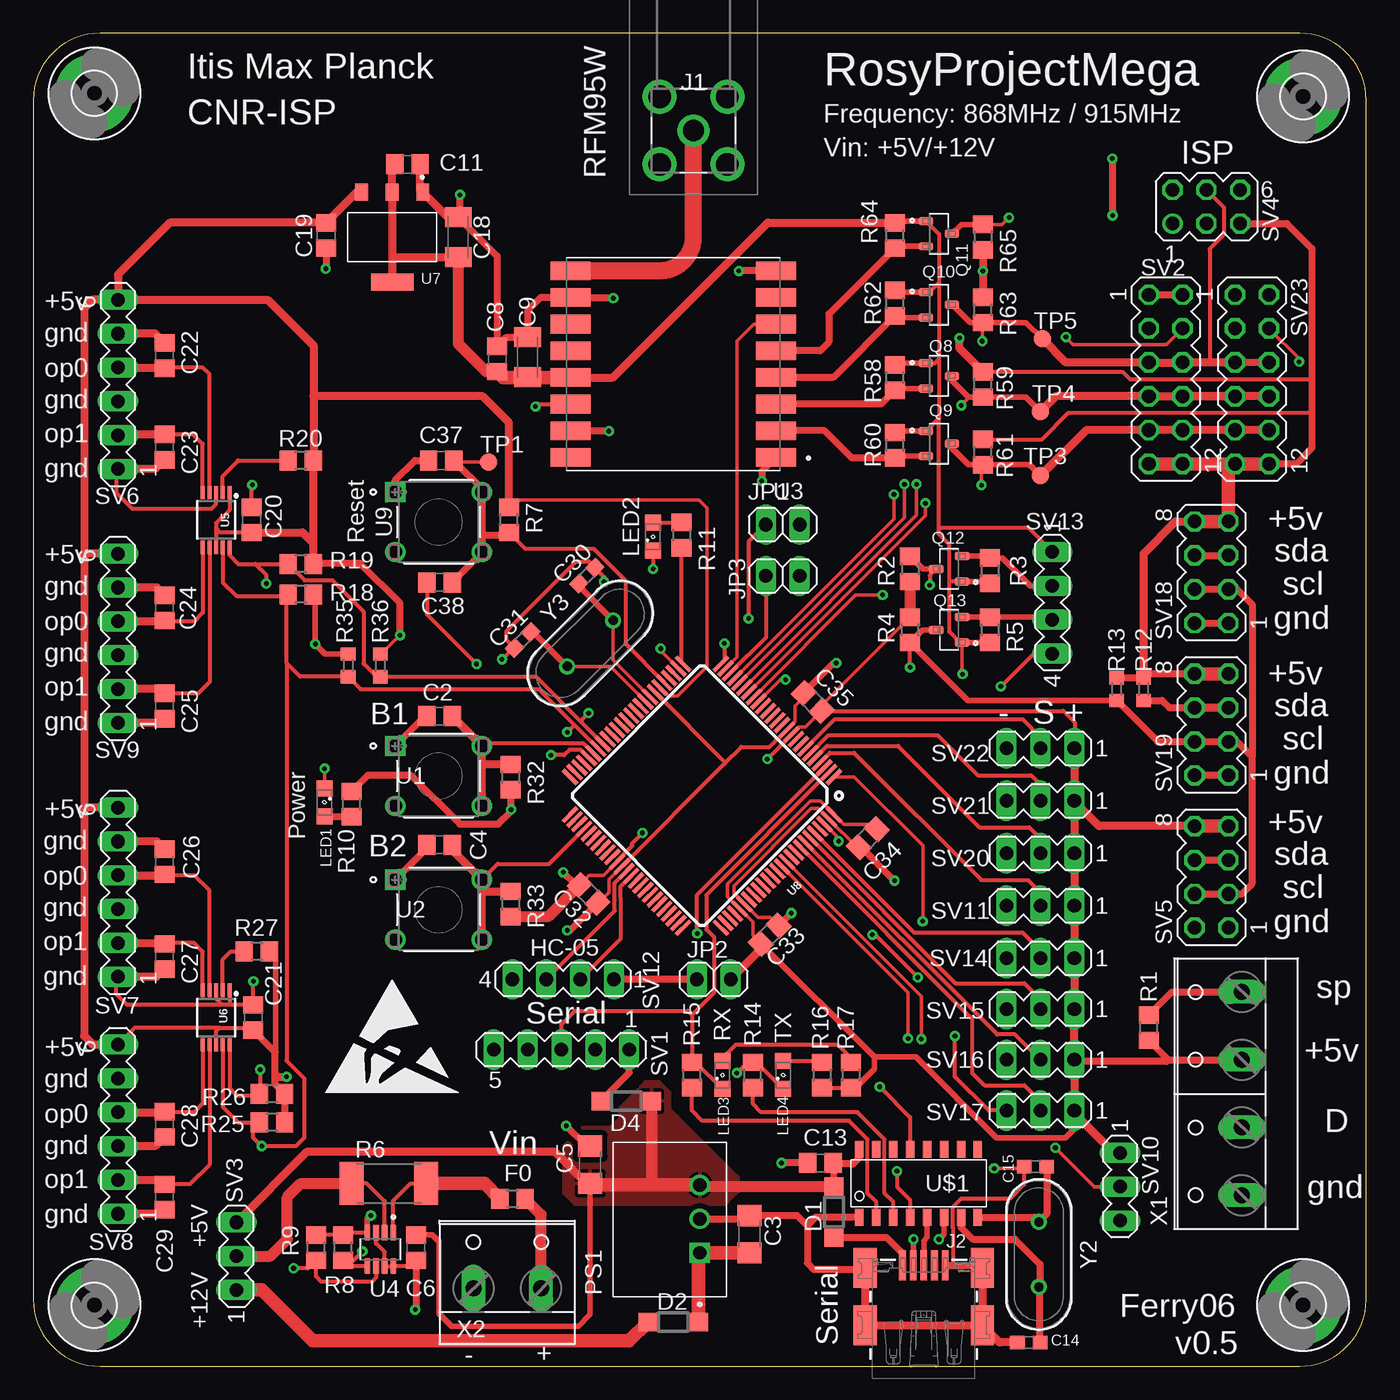
[diagram p5: board, top side]
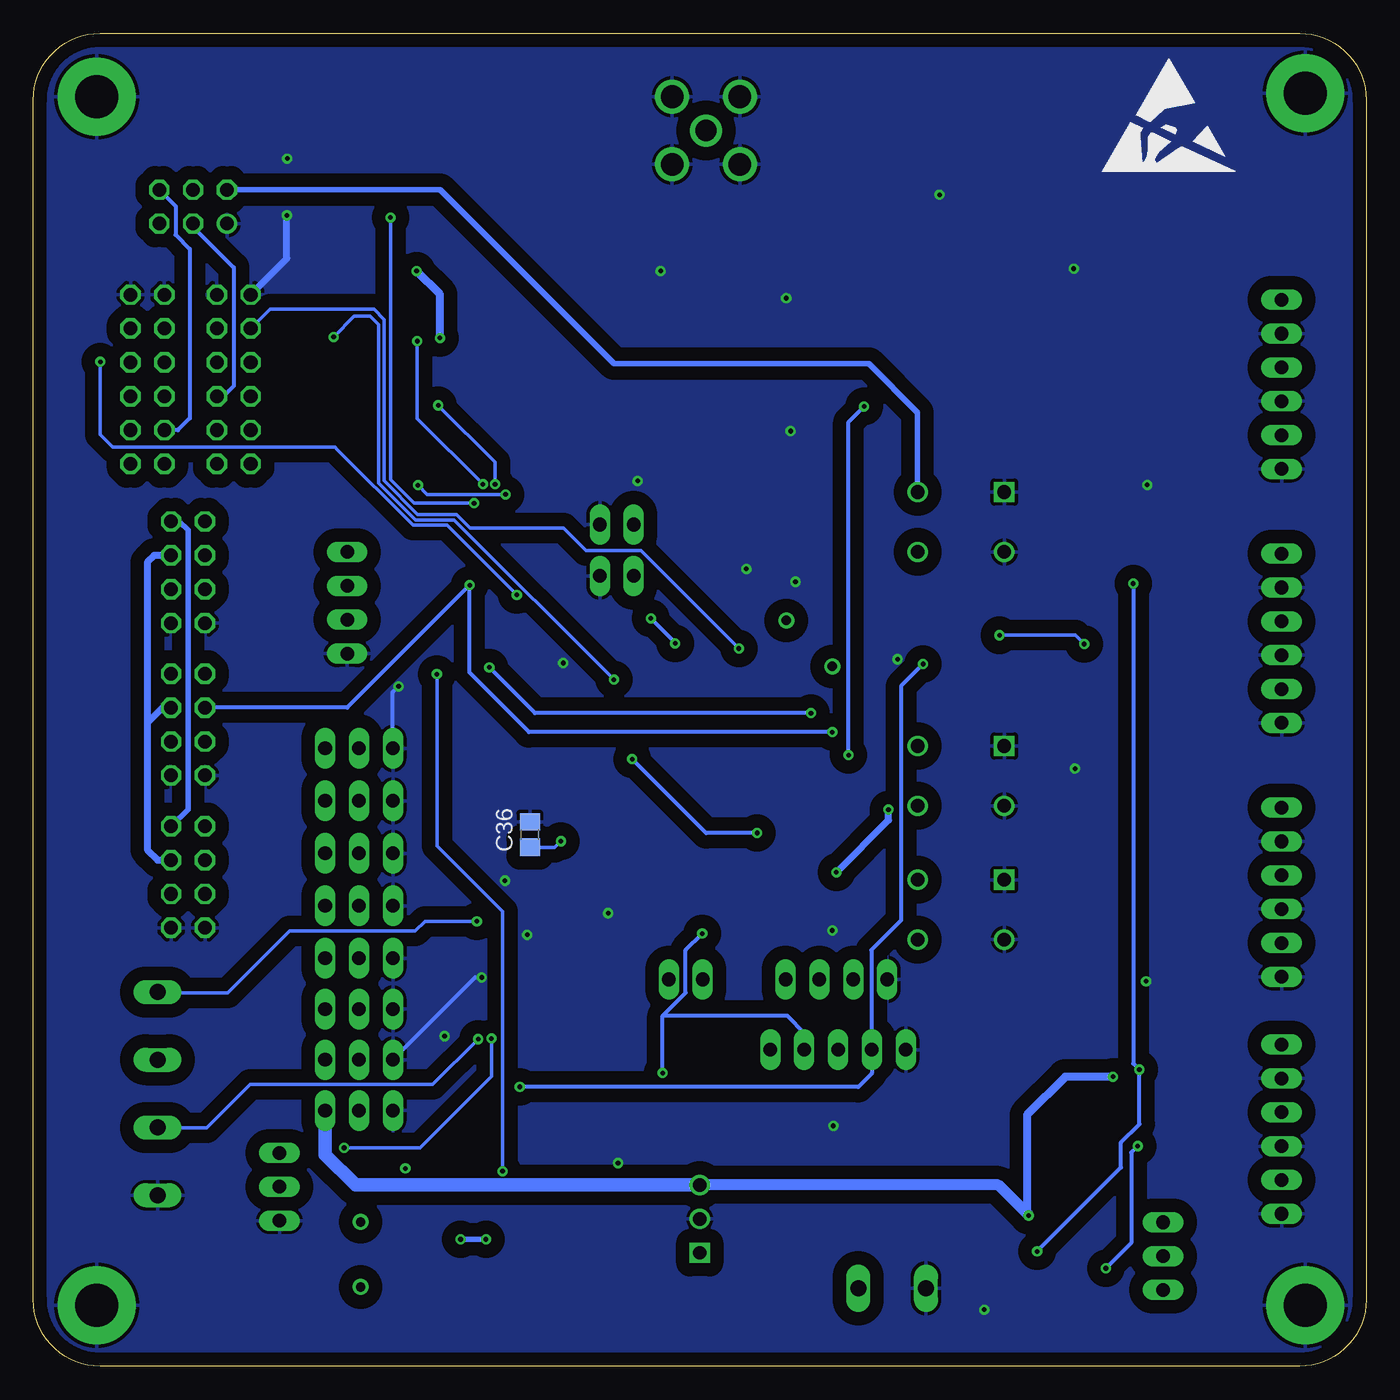
[diagram p6: board, bottom side, seen from below]

Size 100 x 100 mm. Coordinates in mm from the lower left corner, seen from the top.
Outline: 95,100 5,100 arc90 0,95 0,5 arc90 5,0 95,0 arc90 100,5 100,95 arc90 95,100
Copper layers (1*16): Top 0.035mm / dielectric 1.5mm / Bottom 0.035mm
Design rules "default": minimum track width 6mil, minimum drill 0.35mm, track to track 6mil, track to pad 6mil, pad to pad 6mil, via to via 6mil, smd to smd 6mil, copper to edge 40mil, drill to drill 6mil, minimum pad ring 10mil, minimum via ring 8mil, stop-mask expansion 4mil, vias tented up to drill 0mil, thermal gap 10mil

### Footprints (pad centres in the part's own frame; a part is rotated, then mirrored left to right if it is on the bottom)
C0805 = smd 1.3 x 1.5: 1 -0.95,0; 2 0.95,0
C1206 = smd 1.6 x 1.8: 1 -1.4,0; 2 1.4,0
C1206K = smd 1.5 x 2: 1 -1.5,0; 2 1.5,0
C0603 = smd 1.1 x 1: 1 -0.85,0; 2 0.85,0
SOD123 = smd 1.4 x 1.4: A 1.9,0; C -1.9,0
R0805 = smd 1.3 x 1.5: 1 -0.95,0; 2 0.95,0
3,2-PAD = drill 3.2 pad 5.842: B3,2 0,0
518144001 = drill 1.6 pad 2.4: 1 0,0 | drill 1.7 pad 2.55: 2 -2.54,2.54; 3 -2.54,-2.54; 4 2.54,-2.54; 5 2.54,2.54
PMX42_56579-0576 = smd 0.5 x 2.25: 1 1.6,-0.2; 2 0.8,-0.2; 3 0,-0.2; 4 -0.8,-0.2; 5 -1.6,-0.2 | smd 1.75 x 3: S1 -4.4,0; S2 4.4,0; S3 -4.4,4.3; S4 4.4,4.3
1X02 = drill 1.016 long: 1 -1.27,0; 2 1.27,0
SML0805 = smd 1.2 x 1.2: A 1.05,0; C -1.05,0
CONV_R-78E5.0-0.5 = drill 1 square: 1 -2.54,-2.25 | drill 1: 2 0,-2.25; 3 2.54,-2.25
SOT23-3 = smd 0.62 x 1.1: 1 -0.95,-0.975; 2 0.95,-0.975; 3 0,0.975
R2512 = smd 1.8 x 3.2: 1 -2.8,0; 2 2.8,0
R0603 = smd 1 x 1.1: 1 -0.85,0; 2 0.85,0
MA05-1 = drill 1.016 long: 1 -5.08,0; 2 -2.54,0; 3 0,0; 4 2.54,0; 5 5.08,0
MA06-2 = drill 1.016 octagon: 1 -6.35,-1.27; 2 -6.35,1.27; 3 -3.81,-1.27; 4 -3.81,1.27; 5 -1.27,-1.27; 6 -1.27,1.27; 7 1.27,-1.27; 8 1.27,1.27; 9 3.81,-1.27; 10 3.81,1.27; 11 6.35,-1.27; 12 6.35,1.27
MA03-1 = drill 1.016 long: 1 -2.54,0; 2 0,0; 3 2.54,0
MA03-2 = drill 1.016: 1 -2.54,-1.27 | drill 1.016 octagon: 2 -2.54,1.27; 3 0,-1.27; 4 0,1.27; 5 2.54,-1.27; 6 2.54,1.27
MA04-2 = drill 1.016 octagon: 1 -3.81,-1.27; 2 -3.81,1.27; 3 -1.27,-1.27; 4 -1.27,1.27; 5 1.27,-1.27; 6 1.27,1.27; 7 3.81,-1.27; 8 3.81,1.27
MA06-1 = drill 1.016 long: 1 -6.35,0; 2 -3.81,0; 3 -1.27,0; 4 1.27,0; 5 3.81,0; 6 6.35,0
MA04-1 = drill 1.016 long: 1 -3.81,0; 2 -1.27,0; 3 1.27,0; 4 3.81,0
TP13R = smd 1.3 x 1.3: TP 0,0
SWITCH_1-1825910-0 = drill 1.016 pad 1.524 square: 1 -6.502,4.496 | drill 1.016 pad 1.524: 2 -6.502,0; 3 0,0; 4 0,4.496
XCVR_RFM95W-915S2 = smd 3 x 1.4: 1 -7.7,7; 2 -7.7,5; 3 -7.7,3; 4 -7.7,1; 5 -7.7,-1; 6 -7.7,-3; 7 -7.7,-5; 8 -7.7,-7; 9 7.7,-7; 10 7.7,-5; 11 7.7,-3; 12 7.7,-1; 13 7.7,1; 14 7.7,3; 15 7.7,5; 16 7.7,7
SOT65P280X145-8N = smd 1.21 x 0.48: 1 -1.255,0.975; 2 -1.255,0.325; 3 -1.255,-0.325; 4 -1.255,-0.975; 5 1.255,-0.975; 6 1.255,-0.325; 7 1.255,0.325; 8 1.255,0.975
MSOP10 = smd 0.3 x 1: 1 -1,-2.05; 2 -0.5,-2.05; 3 0,-2.05; 4 0.5,-2.05; 5 1,-2.05; 6 1,2.05; 7 0.5,2.05; 8 0,2.05; 9 -0.5,2.05; 10 -1,2.05
SOT-223 = smd 0.96 x 1.26: 1 -2.3,-3.375; 2 0,-3.375; 3 2.3,-3.375 | smd 3.19 x 1.26: 4 0,3.375
TQFP100 = smd 1.5 x 0.3: 1 -8,6; 2 -8,5.5; 3 -8,5; 4 -8,4.5; 5 -8,4; 6 -8,3.5; 7 -8,3; 8 -8,2.5; 9 -8,2; 10 -8,1.5; 11 -8,1; 12 -8,0.5; 13 -8,0; 14 -8,-0.5; 15 -8,-1; 16 -8,-1.5; 17 -8,-2; 18 -8,-2.5; 19 -8,-3; 20 -8,-3.5; 21 -8,-4; 22 -8,-4.5; 23 -8,-5; 24 -8,-5.5; 25 -8,-6; 51 8,-6; 52 8,-5.5; 53 8,-5; 54 8,-4.5; 55 8,-4; 56 8,-3.5; 57 8,-3; 58 8,-2.5; 59 8,-2; 60 8,-1.5; 61 8,-1; 62 8,-0.5; 63 8,0; 64 8,0.5; 65 8,1; 66 8,1.5; 67 8,2; 68 8,2.5; 69 8,3; 70 8,3.5; 71 8,4; 72 8,4.5; 73 8,5; 74 8,5.5; 75 8,6 | smd 0.3 x 1.5: 26 -6,-8; 27 -5.5,-8; 28 -5,-8; 29 -4.5,-8; 30 -4,-8; 31 -3.5,-8; 32 -3,-8; 33 -2.5,-8; 34 -2,-8; 35 -1.5,-8; 36 -1,-8; 37 -0.5,-8; 38 0,-8; 39 0.5,-8; 40 1,-8; 41 1.5,-8; 42 2,-8; 43 2.5,-8; 44 3,-8; 45 3.5,-8; 46 4,-8; 47 4.5,-8; 48 5,-8; 49 5.5,-8; 50 6,-8; 76 6,8; 77 5.5,8; 78 5,8; 79 4.5,8; 80 4,8; 81 3.5,8; 82 3,8; 83 2.5,8; 84 2,8; 85 1.5,8; 86 1,8; 87 0.5,8; 88 0,8; 89 -0.5,8; 90 -1,8; 91 -1.5,8; 92 -2,8; 93 -2.5,8; 94 -3,8; 95 -3.5,8; 96 -4,8; 97 -4.5,8; 98 -5,8; 99 -5.5,8; 100 -6,8
SOIC16 = smd 1.27 x 0.635: 1 -2.54,3.81; 2 -2.54,2.54; 3 -2.54,1.27; 4 -2.54,0; 5 -2.54,-1.27; 6 -2.54,-2.54; 7 -2.54,-3.81; 8 -2.54,-5.08; 9 2.54,-5.08; 10 2.54,-3.81; 11 2.54,-2.54; 12 2.54,-1.27; 13 2.54,0; 14 2.54,1.27; 15 2.54,2.54; 16 2.54,3.81
W237-4P = drill 1.194 long: 1 -7.62,-0.635; 2 -2.54,-0.635; 3 2.54,-0.635; 4 7.62,-0.635
W237-132 = drill 1.194 long: 1 -2.54,-0.635; 2 2.54,-0.635
WE-XTAL_HC49/4H = drill 0.7: 1 -2.44,0; 2 2.44,0

### Placement (x,y rotation side)
C2  30.48,48.77 180 top
C3  53.72,9.91 90 top
C4  30.48,39.12 180 top
C5  41.78,15.11 90 top
C6  28.7,8.89 270 top
C8  34.8,75.56 270 top
C9  37.08,75.69 90 top
C11  28.07,90.17 0 top
C13  59.05,15.24 0 top
C14  74.68,1.78 180 top
C15  75.18,14.99 180 top
C18  31.88,84.71 90 top
C19  21.97,84.84 270 top
C20  16.38,63.5 90 top
C21  16.51,26.16 90 top
C22  9.84,75.82 90 top
C23  9.84,68.96 270 top
C24  9.84,56.9 90 top
C25  9.84,49.53 270 top
C26  9.84,37.85 90 top
C27  9.84,30.73 270 top
C28  9.84,18.16 270 top
C29  9.84,12.7 270 top
C30  41.53,59.31 225 top
C31  36.7,54.48 225 top
C32  41.66,35.43 315 top
C33  55.24,32.38 45 top
C34  62.61,39.62 225 top
C35  58.47,49.83 135 top
C36  62.74,39.88 90 bottom
C37  30.61,67.94 180 top
C38  30.48,58.8 0 top
D1  60.07,11.56 270 top
D2  48.01,3.3 180 top
D4  44.48,19.89 180 top
F0  35.94,12.57 0 top
H1  95.25,4.57 0 top
H2  95.25,95.25 0 top
H3  4.57,4.57 0 top
H4  4.57,95.5 0 top
J1  49.53,92.71 0 top
J2  66.8,7.37 180 top
JP1  56.22,63.14 0 top
JP2  51.05,29.02 180 top
JP3  56.22,59.28 0 top
LED1  21.84,42.29 270 top
LED2  46.48,62.23 90 top
LED3  51.69,21.84 90 top
LED4  56.26,21.84 90 top
PS1  47.75,11.05 90 top
Q8  67.94,74.3 270 top
Q9  67.94,69.22 270 top
Q10  67.94,79.63 270 top
Q11  67.94,84.96 270 top
Q12  68.71,59.82 90 top
Q13  68.71,55.24 90 top
R1  83.69,25.4 90 top
R2  65.79,59.82 270 top
R3  71.75,59.69 270 top
R4  65.79,55.24 90 top
R5  71.75,55.24 270 top
R6  26.67,13.72 0 top
R7  35.69,63.5 90 top
R8  23.24,8.89 90 top
R9  21.21,8.89 90 top
R10  23.88,42.16 90 top
R11  48.64,62.36 270 top
R12  83.31,50.8 90 top
R13  81.28,50.8 90 top
R14  53.98,21.84 90 top
R15  49.4,21.84 90 top
R16  59.18,21.84 270 top
R17  61.34,21.84 270 top
R18  20.07,57.91 180 top
R19  20.07,60.2 180 top
R20  20.07,67.94 180 top
R25  17.91,18.29 180 top
R26  17.91,20.45 180 top
R27  16.76,31.11 180 top
R32  35.81,44.2 270 top
R33  35.81,34.67 270 top
R35  23.62,52.58 90 top
R36  26.04,52.58 90 top
R58  64.64,74.17 90 top
R59  71.25,73.66 90 top
R60  64.64,69.09 90 top
R61  71.25,68.58 90 top
R62  64.64,79.76 90 top
R63  71.25,79.25 90 top
R64  64.64,84.84 90 top
R65  71.25,84.71 270 top
SV1  39.62,23.75 180 top
SV2  84.96,74.04 270 top
SV3  15.24,8.26 90 top
SV4  88.01,87 0 top
SV5  88.39,36.7 90 top
SV6  6.35,73.66 90 top
SV7  6.35,35.56 90 top
SV8  6.35,17.78 90 top
SV9  6.35,54.61 90 top
SV10  81.53,13.46 270 top
SV11  75.56,34.54 180 top
SV12  39.75,29.02 180 top
SV13  76.45,57.28 270 top
SV14  75.56,30.61 180 top
SV15  75.56,26.8 180 top
SV16  75.56,22.99 180 top
SV17  75.56,19.18 180 top
SV18  88.39,59.56 90 top
SV19  88.39,48.13 90 top
SV20  75.56,38.48 180 top
SV21  75.56,42.42 180 top
SV22  75.56,46.35 180 top
SV23  91.44,74.04 270 top
TP1  34.16,67.82 0 top
TP3  75.56,66.8 0 top
TP4  75.56,71.63 0 top
TP5  75.69,77.09 0 top
U1  33.66,42.04 0 top
U2  33.66,32 0 top
U3  48.01,75.18 180 top
U4  26.04,8.76 270 top
U5  13.72,63.5 180 top
U6  13.72,26.16 180 top
U7  26.92,84.71 180 top
U8  50.16,42.8 225 top
U9  33.66,61.09 0 top
U$1  65.79,13.72 90 top
U$2  [ESD_10.00]  19.89,89.51 0 bottom
U$3  [ESD_10.00]  21.84,20.4 0 top
X1  90.04,20.45 90 top
X2  35.56,6.48 0 top
Y2  75.44,8.38 270 top
Y3  41.78,54.23 45 top

### Tracks (layer width: path | path; a pad name or v marks a point on that pad's centre or on a via)
+3V3  (via drill 0.35)
  Top 0.254: Q13.1 69.68,51.96 v69.72,51.92
  Top 0.305: Q11.1 67.94,84.94 67.94,81.28 | 67.94,81.28 67.94,75.56 | 67.94,75.56 67.94,71.12 | 67.94,71.12 66.99,70.17 Q9.1 | Q8.1 67.62,75.25 67.94,75.56 | Q10.1 67.24,80.58 67.94,81.28 | Q13.1 69.54,54.3 68.71,55.12 68.71,58.88 | 67.94,62.87 67.94,62.43 68.71,61.66 68.71,58.88 | 67.94,62.87 67.94,71.12 | SV13.1 74.68,62.87 67.94,62.87 | Q12.1 68.72,58.87 68.71,58.88 | v64.8,14.63 64.8,13.46 65.79,12.47 U$1.4
  Top 0.406: Q11.1 64.77,85.91 R64.2 | Q10.1 64.77,80.58 R62.2 | Q8.1 64.77,75.25 R58.2 | Q9.1 64.77,70.17 R60.2 | Q12.1 71.63,58.87 R3.2 | Q13.1 R5.2
  Top 0.61: C11.1 26.92,89.98 U7.2 26.92,83.19 | 26.92,83.19 U7.4 | C18.1 31.85,83.19 26.92,83.19 | U3.13 43.5,74.18 55.12,85.8 64.63,85.8 R64.2
  Top 0.813: C18.1 31.88,76.71 33.97,74.61 C8.2
  Top 1.016: U3.13 37.09,74.18 | 37.09,74.18 C9.1 | C8.2 35.23,74.18 37.09,74.18
  Bottom 0.254: v69.72,51.92 69.72,39.04 64.8,34.11 v64.8,14.63
+5V  (via drill 0.35)
  Top 0.254: U8.10 56.98,47.49 57.45,47.96 57.94,47.96 C35.1 59.14,49.55 R4.2 | U8.61 42.78,36.83 41.71,36.83 C32.1 | C33.1 53.98,32.31 53.98,33.33 U8.80 52.09,35.21 52.09,36.2 58.29,42.39 59.06,42.39 U8.100 60.81,40.64 62.94,40.64 C34.1 | v27.51,54.84 26.1,53.43 R36.2 | U8.31 47.65,50.27 48.34,50.27 50.55,52.48 50.55,64.39 49.94,65 36.24,65 R7.2
  Top 0.305: U4.4 23.42,10.02 R8.2 R9.2 | U5.1 14.72,64.25 13.72,63.25 13.72,62.87 | 13.72,62.87 U5.8 | C20.1 14.03,62.55 13.72,62.87 | U6.8 13.72,25.15 13.97,25.4 | 13.97,25.4 16.32,25.4 C21.1 | R16.2 R17.2 | C35.1 77.28,49.16 78.13,48.31 78.13,46.38 SV22.1 | U8.61 43.8,37.91 44.92,39.03 44.92,39.23 v45.7,40 | v55.07,45.54 56.98,47.45 56.98,47.49 | R59.2 81.7,74.61 82.27,74.04 95.91,74.04 95.94,74.07 | R61.2 75.68,69.53 77.67,71.53 95.94,71.53 | 13.97,25.4 7.62,25.4 SV8.6
  Top 0.406: R17.2 61.69,20.89 63.09,22.3 63.09,23.19 | 63.09,23.19 C33.1 | SV17.1 78.11,18.97 78.11,17.8 77.44,17.14 72.26,17.14 66.22,23.19 63.09,23.19 | 21.03,61.72 21.03,60.21 R19.1 | R18.1 21.16,57.77 v21.16,54.18 21.91,53.43 R35.2 | C6.1 29.91,9.84 30.43,9.32 30.43,3.94 31.37,3 40.89,3 41.78,3.89 41.78,13.41 C5.1 | U4.4 25.06,11.04 v25.32,11.3 | R27.1 18.19,30.64 18.19,23.59 18.16,23.56
  Top 0.508: D1.C 60.07,15.17 | 60.07,15.17 C13.2 | U$1.16 61.98,15.62 61.53,15.17 60.07,15.17 | R1.1 85.16,22.99 | 85.16,22.99 X1.3 | SV22.1 78.11,42.37 78.11,42.29 | 85.16,22.99 85.03,22.86 78.11,22.86 | R13.2 R12.2 83.61,51.94 SV19.8 | SV4.5 94.06,85.72 95.94,83.84 95.94,74.07 95.94,71.53 95.94,68.89 94.74,67.69 SV23.12 | v27.51,54.84 27.51,57.25 24.54,60.22 21.04,60.22 R19.1 | C32.1 40.7,36.1 v39.75,37.06 | R32.2 35.84,43.22 v35.84,41.76 35.84,41.63 34.87,40.66 32,40.66 28.32,44.35 25.11,44.35 R10.2 | C21.1 18.16,23.56 18.16,21.51 18.16,21.14 R26.1 R25.1
  Top 0.61: SV6.6 4.45,80.01 3.81,79.38 3.81,60.96 | SV8.6 4.45,24.13 3.81,24.77 3.81,41.91 | 3.81,60.96 3.81,41.91 | SV7.6 3.81,41.91 | SV9.6 3.81,60.96 | SV6.6 6.35,81.92 10.22,85.79 C19.1 24.27,88.08 U7.3 | SV5.8 79.96,40.51 78.11,42.37 | SV16.1 78.11,22.86 | SV6.6 17.58,80.01 21.02,76.57 21.02,72.77 | 21.02,72.77 R20.1 R19.1 | C20.1 20.2,62.55 21.03,61.72 | JP2.1 54.57,31.27 C33.1 | R65.2 v71.25,82.17 R63.2 | R59.2 69.49,76.36 v69.49,77.14 | R12.2 83.31,60.98 85.7,63.37 SV18.8 | R7.2 35.69,70.79 33.71,72.77 21.02,72.77 | SV3.3 20.55,16.1 39.09,16.1 41.78,13.41 | 18.16,21.51 18.36,21.72 v19,21.72 | SV22.1 SV21.1 78.11,42.29 SV20.1 SV11.1 SV14.1 SV15.1 SV16.1 | SV16.1 78.11,18.97 81.08,16 SV10.1
  Top 0.813: D1.C 50.13,13.46 PS1.3 | D4.C 46.38,13.61 46.35,13.59 | C32.1 38.6,33.72 R33.2 | R2.2 R4.2
  Top 1.016: PS1.3 46.35,13.59 41.91,13.59 arc-90 C5.1 | SV5.7 SV5.8 | SV19.8 SV19.7 | SV18.8 SV18.7 89.66,67.16 90.19,67.69 | 90.19,67.69 SV23.12 SV23.11 | 90.19,67.69 SV2.11 SV2.12
  Bottom 0.254: v21.16,54.18 21.82,54.84 v27.51,54.84
  Bottom 0.305: v45.7,40 49.53,40 v55.07,45.54
  Bottom 0.406: SV18.7 89.05,63.37 88.39,62.71 88.39,41.78 SV5.7
  Bottom 0.508: v39.75,37.06 35.84,40.97 v35.84,41.76
  Bottom 0.61: v69.49,77.14 69.49,80.42 v71.25,82.17 | v19,21.72 22.58,21.72 25.45,18.85 25.45,11.43 v25.32,11.3
  Bottom 0.813: v25.32,11.3 27.61,13.59 50.24,13.59
  Bottom 1.016: PS1.3 50.24,13.59 75.82,13.59 78.11,15.88 SV17.1
  pour Top (isolate 0.406): 39.78,14.4 39.78,12.93 40.61,12.09 51.92,12.09 52.91,13.08 52.91,14.2 48.34,18.77 47.78,19.33 47.78,20.57 46.99,21.36 45.9,21.36 43.97,19.43 43.97,18.64 43.28,17.96 41.17,17.96 39.78,16.56
+12V
  Top 1.016: D2.C 49.91,8.41 PS1.1 C3.1
A1_N
  Top 0.305: U5.5 12.72,69.2 12,69.91 C23.1
  Top 0.61: C23.1 6.41,69.91 SV6.2
A1_P
  Top 0.305: U5.4 13.22,74.41 12.7,74.93 9.9,74.93 C22.1
  Top 0.61: C22.1 6.41,74.87 SV6.4
A2_N
  Top 0.305: U5.7 13.22,51.32 12.38,50.48 C25.1
  Top 0.61: C25.1 9.52,50.8 SV9.2
A2_P
  Top 0.305: U5.6 12.72,56.53 12.06,55.88 9.78,55.88
  Top 0.61: C24.1 9.78,55.88 SV9.4
ADC1
  Top 0.305: U8.96 66.08,32.54 74.22,32.54 75.56,31.19 SV14.2
ADC2
  Top 0.305: U8.95 69.19,28.73 74.35,28.73 75.56,27.51 SV15.2
ADC3
  Top 0.305: SV16.2 73.66,24.89 72.31,24.89 U8.94
ADC4
  Top 0.305: U8.93 70.43,26.07 70.43,22 71.35,21.08 74.35,21.08 75.56,19.86 SV17.2
ADC7  (via drill 0.35)
  Top 0.254: U8.90 66.62,27.75 v66.62,24.54
  Bottom 0.254: v66.62,24.54 70.03,21.13 83.74,21.13 87,17.88 90.65,17.88 X1.2
ADC8  (via drill 0.35)
  Top 0.254: U8.89 65.63,28.04 v65.63,24.59 | v76.68,16.38 79.6,13.46 SV10.2
  Bottom 0.254: v65.63,24.59 65.63,21.74 70.99,16.38 v76.68,16.38
ANT
  Top 1.27: U3.9 46.99,82.18 arc90 49.53,84.72 J1.1
AREF  (via drill 0.35)
  Top 0.254: v60.42,39.39 60.42,39.61 U8.98
  Bottom 0.254: C36.1 60.88,38.93 v60.42,39.39
B1
  Top 0.305: U8.45 41.3,46.72 33.48,46.72
  Top 0.61: U1.3 33.66,45.14 | 33.66,45.14 U1.4 33.66,46.54 33.48,46.72 C2.1 | R32.1 35.8,45.14 33.66,45.14
B1_N
  Top 0.305: U6.5 12.72,31.1 12.06,31.75 9.91,31.75 C27.1
  Top 0.61: SV7.2 9.78,31.75 C27.1
B1_P
  Top 0.305: U6.4 13.22,35.68 12.06,36.83 9.78,36.83
  Top 0.61: SV7.4 9.78,36.83 C26.1
B2
  Top 0.305: U2.4 34.85,37.69 38.7,37.69 U8.54
  Top 0.61: C4.1 31.43,38.73 U2.4 33.66,35.59 | U2.3 33.66,35.59 | R33.1 35.78,35.59 33.66,35.59
B2_N
  Top 0.305: U6.7 13.22,15.12 11.74,13.65 C29.1
  Top 0.61: SV8.2 9.52,13.97 C29.1
B2_P
  Top 0.305: U6.6 12.72,19.7 12.06,19.05 9.9,19.05 C28.1
  Top 0.61: SV8.4 9.78,19.05 C28.1
CLK
  Top 0.406: Q10.2 64.77,78.68 R62.1
  Top 0.508: R62.1 60.02,74.18 U3.4
CS
  Top 0.406: Q11.2 64.77,84.01 R64.1
  Top 0.508: R64.1 59.69,78.93 59.69,76.83 59.04,76.18 U3.5
CS_A  (via drill 0.35)
  Top 0.254: U8.19 66.93,63.8 v66.93,64.75 | v73.2,86.18 72.68,85.66 R65.1
  Top 0.406: Q11.3 69.62,85.66 R65.1
  Bottom 0.254: v66.93,64.75 71.42,64.75 73.2,66.52 v73.2,86.18
CS_B  (via drill 0.35)
  Top 0.254: U8.18 61.7,57.87 v63.72,57.87 | SV23.4 94.97,75.59 v94.97,75.36
  Bottom 0.254: v63.72,57.87 68.95,63.09 71.5,63.09 77.19,68.78 77.36,68.96 94.06,68.96 94.97,69.88 v94.97,75.36
CS_C  (via drill 0.35)
  Top 0.254: SV2.4 85.01,76.63 78,76.63 77.47,77.17 v77.47,77.22 | U8.17 56.05,51.51 v56.44,51.51
  Bottom 0.254: v77.47,77.22 75.92,78.77 74.73,78.77 74.09,78.13 74.09,66.26 71.33,63.5 68.43,63.5 v56.44,51.51
CS_D  (via drill 0.35)
  Top 0.254: U8.27 47.07,53.68 v47.07,53.85
  Bottom 0.254: SV2.3 82.25,79.3 74.45,79.3 73.69,78.54 73.69,66.43 71.16,63.91 68.26,63.91 67.24,62.89 60.24,62.89 58.53,61.19 54.41,61.19 v47.07,53.85
D0
  Top 0.305: U8.4 59.76,46.02 61.57,46.02 71.12,36.47 74.62,36.47 75.56,35.53 SV11.2
D1
  Top 0.305: U8.5 59.56,46.53 64.87,46.53 70.97,40.44 74.73,40.44 75.56,39.6 SV20.2
D2
  Top 0.305: U8.6 59.66,47.35 67.84,47.35 70.87,44.32 74.88,44.32 75.56,43.64 SV21.2
D3
  Top 0.305: U8.7 60.15,48.54 74.19,48.54 75.56,47.17 SV22.2
DI
  Top 0.406: Q8.2 64.77,73.34 R58.1
  Top 0.508: R58.1 63.61,72.18 U3.3
DIO0  (via drill 0.35)
  Top 0.305: v38.84,45.85 39.82,45.85 40.22,46.24 41.07,46.24 U8.46 | v37.67,72.01 37.84,72.18 U3.14
  Bottom 0.305: v38.84,45.85 38.84,70.84 v37.67,72.01
DO
  Top 0.406: Q9.2 64.77,68.27 R60.1
  Top 0.508: R60.1 61.4,68.14 59.36,70.18 U3.2
DTR  (via drill 0.35)
  Top 0.305: v63.5,20.95 65.79,18.67 U$1.13 | C38.1 29.53,56.4 v33.25,52.68
  Bottom 0.305: v63.5,20.95 38.1,20.95 37.08,21.97 SV1.4 37.13,23.8 37.13,31.22 34.9,33.45 34.9,51.03 v33.25,52.68
GND  (via drill 0.35)
  Top 0.254: U8.11 57.15,48.37 57.15,49.53 57.8,50.18 C35.2 | U8.62 43.18,36.52 43.18,35.56 42.38,34.76 C32.2 | C33.2 55.32,33.66 54.36,33.66 U8.81 52.55,35.46 52.55,36.04 58.34,41.83 58.91,41.83 U8.99 61.79,38.95 C34.2 | C15.2 74.18,14.83 v72.08,14.83 | LED1.C v21.84,44.83
  Top 0.305: U4.3 25.71,9.21 26.36,8.56 U4.7 U4.8 28.27,7.51 C6.2 | 14.61,27.11 C21.2 v16.51,28.88 | 14.61,27.11 14.16,27.11 | U6.3 13.72,27.56 14.16,27.11 | U6.1 14.72,27.22 14.61,27.11 | U8.62 51.87,45.21 | 51.87,45.21 53.12,46.46 55.24,46.46 U8.11 | U8.32 51.87,45.34 51.87,45.21 | 14.16,27.11 7.03,27.11 6.22,27.91 6.22,29.08 SV7.1 | U5.3 13.72,64.67 13.36,64.31 7.44,64.31 6.25,65.51 6.25,67.21 SV6.1 | v35.15,53.03 36,53.88 C31.2 35.51,54.48 35.51,55.17 40.72,60.38 41.66,60.38 C30.1 42.82,59.22 v42.82,58.85 | LED2.C 46.48,59.84 v46.51,59.82 | C20.2 16.38,66.06 v16.43,66.12 | C15.2 74.33,13.63 73.28,12.57 69.61,12.57 68.97,11.94 68.97,10.41 68.99,10.4 68.99,7.57 | v72.59,51 75.06,53.47 SV13.4 | v66.36,29.17 63.17,32.36 v62.95,32.36 | SV17.3 71.68,19.18 69.14,21.72 v69.14,24.77
  Top 0.508: C6.2 28.7,4.29 v28.65,4.24 | C5.2 41.5,16.51 v39.98,18.03 | C13.1 v56.13,15.24 | PS1.2 53.46,11.05 C3.2 57.3,11.31 58.06,10.54 | J2.5 68.99,7.57 71,7.57 J2.S1 | U$1.1 58.7,11.18 58.06,10.54 | 58.06,10.54 58.06,7.75 58.55,7.26 62.3,7.26 J2.S2 | U9.1 27.15,66.47 28.63,67.94 C37.2 | U1.1 29.39,48.77 C2.2 | U2.1 29.53,38.88 C4.2 | C32.2 40.26,32.69 v40.06,32.69 | C33.2 56.84,33.98 v56.87,33.98 | C34.2 62.09,38.95 v64.62,36.42 | C35.2 60.05,52.76 v60.25,52.76 | v43.51,80.14 43.46,80.18 U3.10 38.07,80.18 37.08,79.2 C9.2 35.48,77.19 C8.1 34.8,83.29 C18.2 32,86.34 v32,87.88 | U3.15 43.15,70.18 v43.18,70.16 | U3.8 52.95,82.18 v52.93,82.17 | U3.1 54.66,67.14 v54.66,66.42 | C19.2 21.97,82.37 v21.95,82.35 | SV19.1 SV19.2 | SV18.2 SV18.1 | SV2.1 SV2.2 | v80.97,86.33 80.97,90.58 v80.95,90.6
  Top 0.61: C28.2 9.14,16.51 SV8.3 | C29.2 9.52,11.43 SV8.1 | C27.2 9.27,29.21 SV7.1 | C26.2 9.27,39.37 SV7.5 | C25.2 9.52,48.26 SV9.1 | C24.2 9.27,58.42 SV9.5 | C23.2 9.14,67.31 SV6.1 | C22.2 9.14,77.47 SV6.5 | C18.2 31.1,86.21 U7.1 29.02,88.29 C11.2 | J2.S2 J2.S4 J2.S3 | J2.S1 J2.S3 | C14.2 72.49,1.78 J2.S3
  Bottom 0.305: SV22.3 73.03,50.57 v72.59,51 | SV16.3 66.84,29.17 v66.36,29.17
  Bottom 0.508: SV2.1 80.97,83.11 v80.97,86.33
  pour Bottom (isolate 1.016): -2.97,102.69 102.62,102.69 102.79,102.51 102.79,-2.49 102.31,-2.97 -3.3,-2.97 -4.29,-1.98 -4.29,101.4 -4.27,101.4
L1
  Top 0.305: U8.26 48.64,52.81 R11.2
MISO  (via drill 0.35)
  Top 0.254: U8.22 64.57,63.56 v64.57,65.41 | v71.14,66.09 71.14,67.53 R61.1
  Top 0.406: Q9.3 68.92,68.88 70.17,67.63 R61.1 74.74,67.63 TP3.TP
  Top 0.508: 90.3,70.23 86.21,70.23
  Top 0.61: SV2.9 78.99,70.23 TP3.TP | SV2.10 86.21,70.23 SV2.9 | SV23.10 90.3,70.23 | SV23.9 SV2.10 | SV2.10 SV2.9
  Bottom 0.254: v64.57,65.41 70.46,65.41 v71.14,66.09
  Bottom 0.305: SV4.6 89.33,87.05 89.33,84.88 88.27,83.81 88.27,71.12 89.15,70.23 SV23.9
MOSI  (via drill 0.35)
  Top 0.254: U8.21 65.36,63.65 v65.36,66.17 | v69.62,72.08 70.17,72.63 70.17,72.71
  Top 0.406: Q8.3 68.92,73.95 70.17,72.71 R59.1 74.48,72.71 TP4.TP
  Top 0.508: 90.14,72.77 86.31,72.77
  Top 0.61: TP4.TP 76.71,72.77 SV2.7 SV2.8 SV23.7 | SV23.8 SV23.7 | SV23.7 90.14,72.77 | SV23.7 86.31,72.77
  Bottom 0.254: v65.36,66.17 65.36,67.82 v69.62,72.08
  Bottom 0.305: SV4.3 88.01,85.47 84.96,82.42 84.96,73.53 85.72,72.77 SV2.8
N$1
  Top 0.508: JP2.2 SV12.1
N$3
  Top 1.016: SV3.1 17.14,5.71 20.95,1.91 44.71,1.91 D2.A
N$10
  Top 0.508: LED1.A 23.85,41.24 R10.1
N$11
  Top 0.305: LED2.A 48.61,63.28 R11.1
N$13
  Top 0.305: U$1.2 63.25,12.32 62.6,12.97 62.6,17.02 61.2,18.41 50.16,18.41 49.4,19.18 R15.1
N$14
  Top 0.305: U$1.3 64.52,12.32 63.87,12.97 63.87,17.02 61.84,19.05 54.61,19.05 53.98,19.68 R14.1
N$15
  Top 0.508: C15.1 76.03,11.42 Y2.1 75.08,11.18 U$1.8
N$16
  Top 0.508: C14.1 75.53,5.85 | 75.53,5.85 Y2.2 | U$1.7 69.6,10.41 70.48,9.53 73.66,9.53 75.53,7.66 75.53,5.85
N$17
  Top 0.305: LED3.A 51.69,23.11 52.7,24.13 60.33,24.13 61.34,23.11 R17.1
N$18
  Top 0.305: LED4.A 59.08,22.89 R16.1
N$22
  Top 0.305: U5.2 14.22,66.79 15.37,67.94 R20.2
N$23
  Top 0.254: Y3.2 43.51,52.99 U8.33
  Top 0.406: Y3.2 40.93,58.53 C30.2
N$24
  Top 0.508: D4.A 44.7,22.02 SV1.1
N$25
  Top 0.305: U6.2 14.22,30.52 14.81,31.11 R27.2
N$27
  Top 0.254: Y3.1 43.29,52.5 U8.34
  Top 0.406: Y3.1 37.48,55.08 C31.1
NRST
  Top 0.254: TP1.TP 31.85,67.82 31.77,67.73
  Top 0.305: U8.30 44.42,54.2 44.42,58.96 42.04,61.34 36.9,61.34 R7.1
  Top 0.508: C37.1 31.77,67.73 33.66,65.85 U9.4 33.66,62.33 | 33.66,62.33 U9.3 33.66,61.03 C38.2 | R7.1 35.47,62.33 33.66,62.33
  Bottom 0.406: SV4.2 69.49,88.27 56.44,75.21 37.31,75.21 33.66,71.55 U9.4
PWM1  (via drill 0.35)
  Top 0.305: JP1.1 53.67,61.86 v53.67,56.11 | v51.84,54.23 51.84,52.96 U8.25
  Bottom 0.305: v53.67,56.11 51.84,54.28 v51.84,54.23
PWM2
  Top 0.305: JP3.1 54.95,54.66 U8.23
RST
  Top 0.254: U8.24 52.81,53.22 52.81,76.91 54.08,78.18 U3.6
RX0
  Top 0.305: LED3.C 49.69,22.79 R15.2 49.4,26.37 | U8.2 50.49,35.35 50.49,32.77 51.05,32.21 51.05,28.02 49.4,26.37 | SV1.3 39.62,25.65 40.64,26.67 49.1,26.67 49.4,26.37
RXB
  Top 0.305: SV12.3 43.62,34.16 43.62,34.96 43.61,34.97 43.61,36.25 U8.63
SCK  (via drill 0.35)
  Top 0.254: U8.20 66.27,63.85 v66.27,66.17 | v71.2,76.91 71.2,78.25 R63.1
  Top 0.305: 88.27,75.31 88.27,83.83 89.33,84.9 89.33,86.94 SV4.4
  Top 0.406: Q10.3 68.96,79.63 70.29,78.3 R63.1 74.48,78.3 TP5.TP
  Top 0.508: SV23.6 SV23.5
  Top 0.61: TP5.TP 77.47,75.31 SV2.5 SV2.6 88.27,75.31 SV23.5
  Bottom 0.254: v66.27,66.17 71.2,71.09 v71.2,76.91
SCL  (via drill 0.35)
  Top 0.305: U4.5 23.67,7.51 R8.1 24.02,7.94 v24.69,8.61 | U6.10 14.72,20.84 15.24,20.32 16.83,20.32 R26.2 17.02,20.51 v17.02,22.25 | U5.10 14.72,60.85 15.37,60.2 16.66,60.2 | 16.66,60.2 R19.2 20.35,58.97 22.43,58.97 24.77,56.63 24.77,52.7 25.74,51.73 R36.1 34.57,51.73 37.7,51.73 41.13,48.3 | 41.13,48.3 U8.43 | 16.66,60.2 17.48,59.38 v17.48,58.73 | 41.13,48.3 41.13,48.47 v41.66,49 | v65.79,52.43 R4.1
  Top 0.406: Q13.3 66.74,55.24 66.68,55.19 R4.1 70.13,49.95 R13.1
  Top 0.508: SV5.4 SV5.3 90.68,35.43 91.44,36.2 91.44,45.72 | SV18.4 SV18.3 90.3,58.29 91.44,57.15 91.44,45.72 | 91.44,45.72 90.3,46.86 SV19.3 SV19.4 84.37,46.86 R13.1
  Bottom 0.305: v17.48,58.73 17.48,22.71 v17.02,22.25 17.02,18.16 18.39,16.79 18.39,14.91 v24.69,8.61 | v41.66,49 62.36,49 v65.79,52.43
SCL3
  Top 0.406: Q13.2 R5.1 76.27,56.2 SV13.3
SDA  (via drill 0.35)
  Top 0.305: U4.6 25.71,6.66 25.4,6.35 21.59,6.35 21.21,6.73 R9.1 20.61,7.34 v19.53,7.34 | U6.9 14.22,19.44 15.37,18.29 16.51,18.29 | 16.51,18.29 R25.2 | U5.9 14.22,58.81 15.24,57.78 18.99,57.78 | 18.99,57.78 R18.2 | 18.99,52.77 18.99,57.78 | 18.99,52.77 20.03,51.73 R35.1 24.55,50.8 37.92,50.8 40.56,48.16 | 18.99,52.77 18.99,22.92 20.32,21.59 20.32,17.14 19.68,16.51 v17.14,16.51 16.51,17.14 16.51,18.29 | 40.56,48.16 U8.44 | Q12.3 67.26,59.34 v67.26,58.6 | 40.56,48.16 40.56,48.08 v40.06,47.57
  Top 0.406: R2.1 66.68,59.87 66.74,59.82 Q12.3
  Top 0.508: SV5.6 SV5.5 | R12.1 84.67,49.95 85.22,49.4 SV19.6 | SV18.6 SV18.5
  Top 0.61: SV19.6 SV19.5
  Bottom 0.305: v19.53,7.34 17.63,9.25 17.63,16.03 v17.14,16.51 | SV19.6 76.45,49.4 v67.26,58.6 67.28,58.57 67.28,52.05 62.81,47.57 v40.06,47.57
  Bottom 0.508: SV18.5 90.93,60.83 91.44,60.33 91.44,48.26 | 91.44,48.26 91.44,38.73 90.68,37.97 SV5.5 | 91.44,48.26 90.3,49.4 SV19.5
SDA3
  Top 0.406: Q12.2 71.63,60.77 R3.1 72.71,60.64 74.8,58.55 SV13.2
SPEED  (via drill 0.35)
  Top 0.254: U8.1 61.58,44.21 66.73,39.06 v66.73,33.38
  Top 0.508: R1.2 85.41,28.07 X1.4
  Bottom 0.254: v66.73,33.38 70.61,33.38 71.35,32.64 80.77,32.64 85.42,27.99 90.6,27.99 X1.4
TX0  (via drill 0.35)
  Top 0.305: LED4.C 54.26,22.79 R14.2 53.58,22.79 v52.78,22 | v49.81,32.46 49.81,35.37 U8.3
  Bottom 0.305: v52.78,22 52.78,26.29 | v49.81,32.46 51.05,31.22 51.05,28.02 52.78,26.29 | SV1.2 42.16,25.02 43.44,26.29 52.78,26.29
TXB
  Top 0.305: SV12.2 44.08,32.08 44.08,35.15 44.07,35.16 44.07,36.01 U8.64
UD+
  Top 0.406: U$1.5 67.06,9.68 66.8,9.42 J2.3
UD-  (via drill 0.35)
  Top 0.406: U$1.6 68.33,9.91 v67.94,9.53 | v66.04,9.53 66.04,7.6 J2.2
  Bottom 0.406: v67.94,9.53 v66.04,9.53
VBUS
  Top 0.508: D1.A 64,9.66 65.2,8.46 J2.1
VCC
  Top 0.813: X2.2 38.1,11.36 F0.2
VIN+
  Top 0.305: U4.1 27.01,12.4 28.32,13.72 R6.2
  Top 1.016: F0.1 33.85,13.72 R6.2
VIN-
  Top 0.305: U4.2 26.36,12.38 25.02,13.72 R6.1
  Top 0.813: SV3.2 17.78,8.26 19.05,9.53 19.05,12.7 20.07,13.72 R6.1
(copper drawn outside any net)
  shapes: Top area x2

### Text on the board
tNames: Itis Max Planck | RosyProjectMega | CNR-ISP | Frequency: 868MHz / 915MHz | Vin: +5V/+12V | ISP | RFM95W | +5v | gnd | op0 | gnd | op1 | gnd | +5v | Reset | +5v | sda | gnd | scl | op0 | gnd | gnd | +5v | op1 | sda | gnd | B1 | - | S | + | scl | gnd | +5v | Power | +5v | gnd | B2 | sda | op0 | scl | gnd | gnd | op1 | HC-05 | gnd | sp | Serial | RX | TX | +5v | +5v | gnd | op0 | D | gnd | Vin | op1 | gnd | gnd | +5V | Ferry06 | +12V | Serial | v0.5 | - | +